# Altium project main_pcb_v1_0.PrjPcb (part 1 of 2)
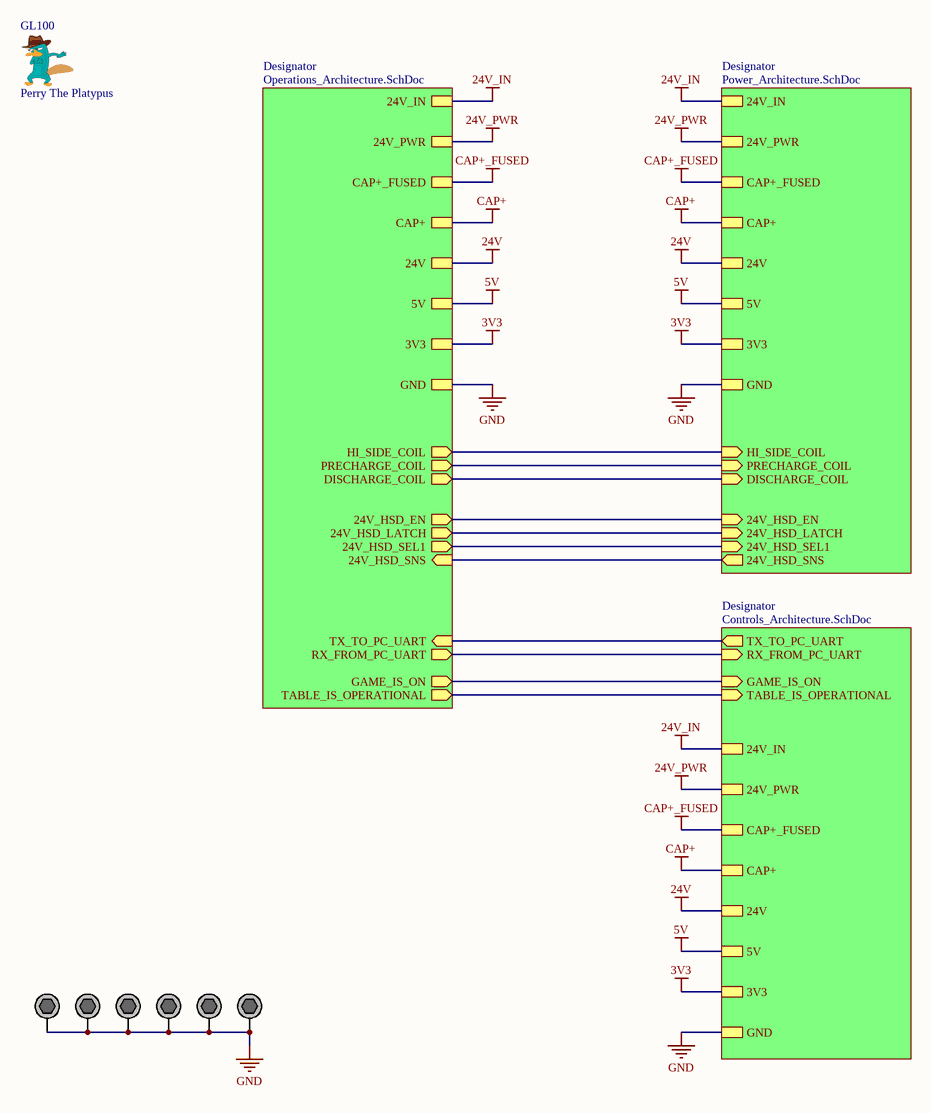
[diagram p0: Top_Level.SchDoc]
13 sheets, 195 parts. Net scope: strictly hierarchical (ports join the sheet entries above them; power ports are local).
Board file: main_pcb.PcbDoc
Sheets:
  Top_Level.SchDoc
    Designator = Power_Architecture.SchDoc
      Designator = 5V_Regulator.SchDoc
      Designator = 3V3_Regulator.SchDoc
    Designator = Operations_Architecture.SchDoc
      Designator = Relay_Control.SchDoc
      Designator = Monitoring.SchDoc
      Designator = Shutdown_Nodes.SchDoc
      Designator = Operations_Microcontroller.SchDoc
      Designator = MAX3232.SchDoc
    Designator = Controls_Architecture.SchDoc
      Designator = Controls_Microcontroller.SchDoc
      A = I_Sensing.SchDoc
      B = I_Sensing.SchDoc

## Sheet Top_Level.SchDoc: Top Level
size Letter; Date: Oct-10-2023; Author: Joe Thurston; DrawnBy: Joe Thurston; Engineer: Joe Thurston; SheetNumber: 1; SheetTotal: 13

### Parts
GL100  Perry The Platypus  [Perry the Platypus]  (no BOM)
MH100  M3 Mounting Hole Plated  [M3 Screw Hole - Plated]  (value not drawn)  (no BOM)
MH101  M3 Mounting Hole Plated  [M3 Screw Hole - Plated]  (value not drawn)  (no BOM)
MH102  M3 Mounting Hole Plated  [M3 Screw Hole - Plated]  (value not drawn)  (no BOM)
MH103  M3 Mounting Hole Plated  [M3 Screw Hole - Plated]  (value not drawn)  (no BOM)
MH104  M3 Mounting Hole Plated  [M3 Screw Hole - Plated]  (value not drawn)  (no BOM)
MH105  M3 Mounting Hole Plated  [M3 Screw Hole - Plated]  (value not drawn)  (no BOM)

### Sub-sheets
Designator = Power_Architecture.SchDoc: HI_SIDE_COIL (in), PRECHARGE_COIL (in), DISCHARGE_COIL (in), 24V_IN, 5V, 3V3, GND, 24V_PWR, CAP+_FUSED, CAP+, 24V, 24V_HSD_SEL1 (in), 24V_HSD_SNS (out), 24V_HSD_LATCH (in), 24V_HSD_EN (in)
Designator = Operations_Architecture.SchDoc: HI_SIDE_COIL (out), PRECHARGE_COIL (out), DISCHARGE_COIL (out), 24V_IN, 5V, 3V3, GND, 24V_PWR, CAP+_FUSED, CAP+, 24V, GAME_IS_ON (out), TABLE_IS_OPERATIONAL (out), TX_TO_PC_UART (in), RX_FROM_PC_UART (out), 24V_HSD_EN (out), 24V_HSD_LATCH (out), 24V_HSD_SEL1 (out), 24V_HSD_SNS (in)
Designator = Controls_Architecture.SchDoc: GAME_IS_ON (in), TABLE_IS_OPERATIONAL (in), 24V_IN, 5V, 3V3, GND, 24V_PWR, CAP+_FUSED, CAP+, 24V, TX_TO_PC_UART (out), RX_FROM_PC_UART (in)

### Nets
3V3: sheet Designator/3V3, sheet Designator/3V3, sheet Designator/3V3
5V: sheet Designator/5V, sheet Designator/5V, sheet Designator/5V
24V: sheet Designator/24V, sheet Designator/24V, sheet Designator/24V
24V_IN: sheet Designator/24V_IN, sheet Designator/24V_IN, sheet Designator/24V_IN
24V_PWR: sheet Designator/24V_PWR, sheet Designator/24V_PWR, sheet Designator/24V_PWR
CAP+: sheet Designator/CAP+, sheet Designator/CAP+, sheet Designator/CAP+
CAP+_FUSED: sheet Designator/CAP+_FUSED, sheet Designator/CAP+_FUSED, sheet Designator/CAP+_FUSED
GND: MH100.1 MH101.1 MH102.1 MH103.1 MH104.1 MH105.1 ; sheet Designator/GND, sheet Designator/GND, sheet Designator/GND
DISCHARGE_COIL: sheet Designator/DISCHARGE_COIL, sheet Designator/DISCHARGE_COIL
HI_SIDE_COIL_CURRENT: sheet Designator/HI_SIDE_COIL, sheet Designator/HI_SIDE_COIL
PRECHARGE_COIL_CURRENT: sheet Designator/PRECHARGE_COIL, sheet Designator/PRECHARGE_COIL
NetC202_2: sheet Designator/24V_HSD_SNS, sheet Designator/24V_HSD_SNS
NetR201_2: sheet Designator/24V_HSD_SEL1, sheet Designator/24V_HSD_SEL1
NetR206_2: sheet Designator/24V_HSD_LATCH, sheet Designator/24V_HSD_LATCH
NetR207_2: sheet Designator/24V_HSD_EN, sheet Designator/24V_HSD_EN
NetTP1302_1: sheet Designator/TABLE_IS_OPERATIONAL, sheet Designator/TABLE_IS_OPERATIONAL
NetTP1304_1: sheet Designator/GAME_IS_ON, sheet Designator/GAME_IS_ON
NetU800_9: sheet Designator/RX_FROM_PC_UART, sheet Designator/RX_FROM_PC_UART
NetU800_10: sheet Designator/TX_TO_PC_UART, sheet Designator/TX_TO_PC_UART

### Library data of the parts
MH100-MH105 = CMP-019-000000-2: Source: UBC Formula Electric.SchLib; Design Item ID: M3 Mounting Hole Plated

## Sheet Power_Architecture.SchDoc
size Tabloid; SheetNumber: 2; SheetTotal: 13
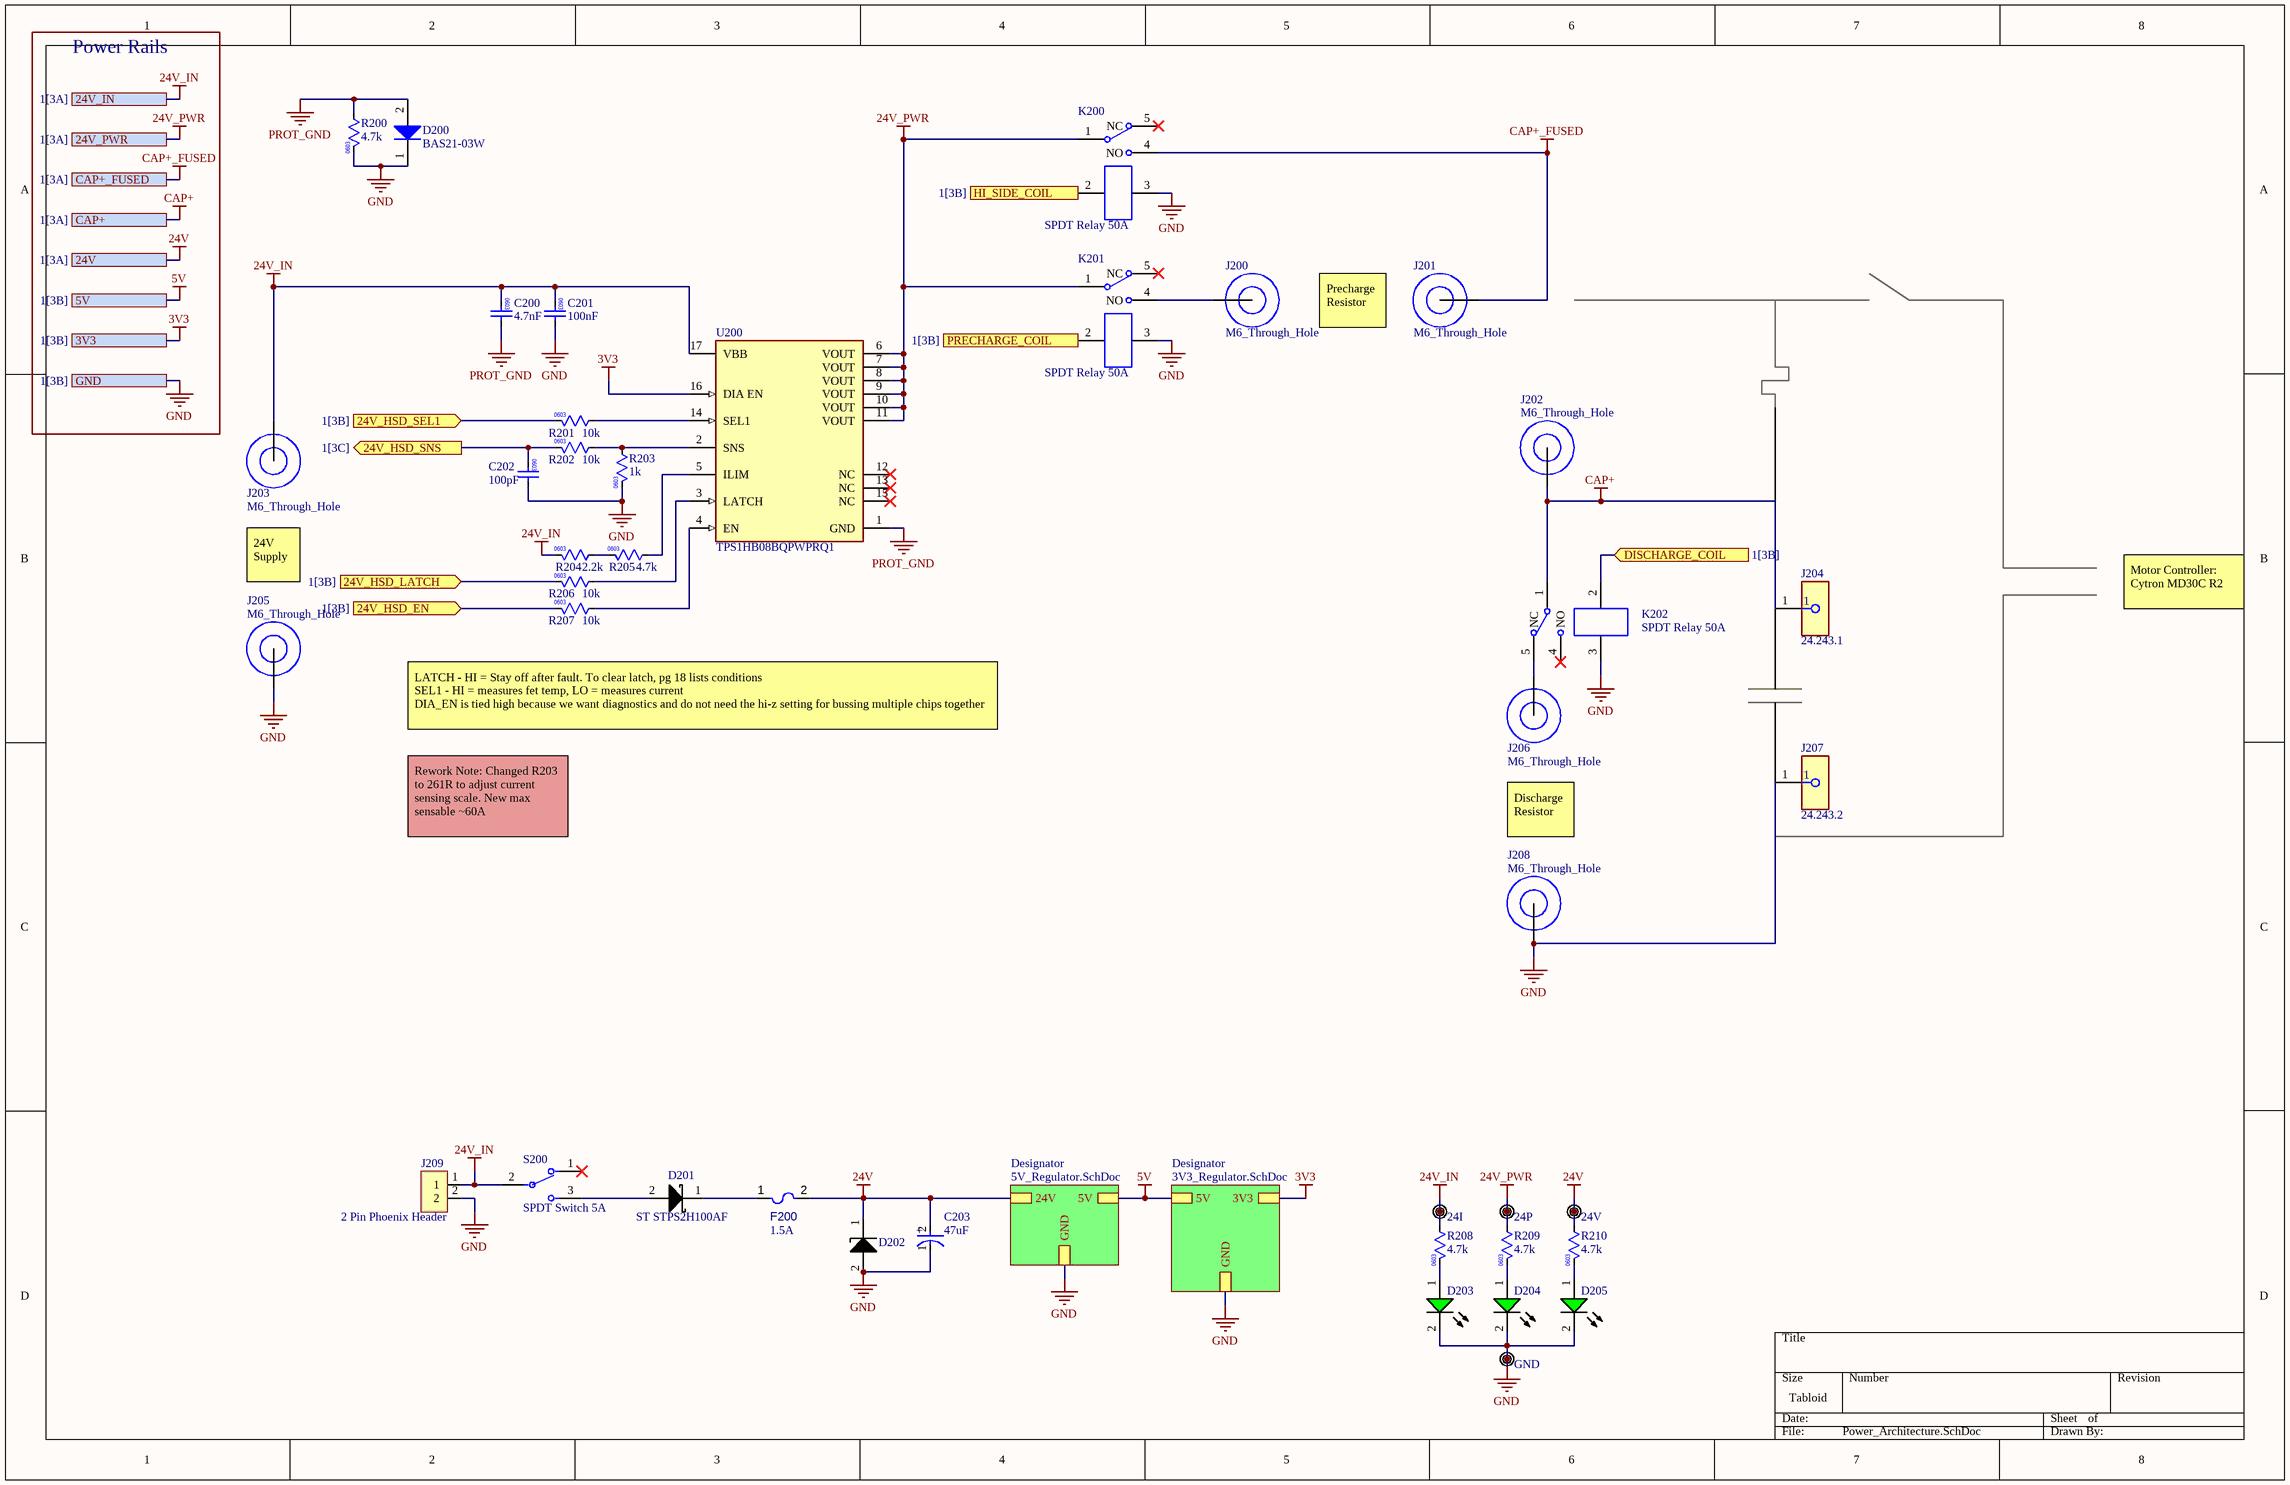
[diagram p1: Power_Architecture.SchDoc]

### Parts
C200  value 4.7nF  [0603 Capacitor Footprint]  (hidden comment: 0603 4.7nF 10% 50V)
C201  value 100nF  [0603 Capacitor Footprint]  (hidden comment: 0603 0.1uF 5% 50V)
C202  value 100pF  [0603 Capacitor Footprint]  (hidden comment: 0603 100pF 10% 50V)
C203  Capacitance: 47uF  [FP-FPD-MFG]  (hidden comment: EEEFP1V470AP)
D200  BAS21-03W  [INF-SOD323_V]
D201  ST STPS2H100AF  [ST STPS2H100AF]
D202  Vishay SMAJ24A-E3/5A  [VISHAY SMAJ24A-E3/5A (DO214AC/SMA)]  (value not drawn)
D203  Lite-On LTST-C193KGKT-5A  [Lite-On LTST-C193KGKT-5A GREEN (1608)]  (value not drawn)
D204  Lite-On LTST-C193KGKT-5A  [Lite-On LTST-C193KGKT-5A GREEN (1608)]  (value not drawn)
D205  Lite-On LTST-C193KGKT-5A  [Lite-On LTST-C193KGKT-5A GREEN (1608)]  (value not drawn)
F200  Current Rating: 1.5A  [LFUS-467_V]  (hidden comment: 1.5A 32V Fuse 0603)
GND  Thru-Hole Test Point  [TESTPOINT]  (value not drawn)  (no BOM)
J200  M6_Through_Hole  [M6_Through_Hole]  (no BOM)
J201  M6_Through_Hole  [M6_Through_Hole]  (no BOM)
J202  M6_Through_Hole  [M6_Through_Hole]  (no BOM)
J203  M6_Through_Hole  [M6_Through_Hole]  (no BOM)
J204  24.243.1  [FP-24_243_1-MFG]
J205  M6_Through_Hole  [M6_Through_Hole]  (no BOM)
J206  M6_Through_Hole  [M6_Through_Hole]  (no BOM)
J207  24.243.2  [FP-24_243_2-MFG]
J208  M6_Through_Hole  [M6_Through_Hole]  (no BOM)
J209  2 Pin Phoenix Header  [2 Pin Phoenix Header]
K200  SPDT Relay 50A  [SPDT Relay 50A]
K201  SPDT Relay 50A  [SPDT Relay 50A]
K202  SPDT Relay 50A  [SPDT Relay 50A]
R200  value 4.7k  [0603 Resistor Footprint]  (hidden comment: 0603 4k7 1% 0.33W)
R201  value 10k  [0603 Resistor Footprint]  (hidden comment: 0603 10k 1% 0.3W)
R202  value 10k  [0603 Resistor Footprint]  (hidden comment: 0603 10k 1% 0.3W)
R203  value 1k  [0603 Resistor Footprint]  (hidden comment: 0603 1k 1% 0.33W)
R204  value 2.2k  [0603 Resistor Footprint]  (hidden comment: 0603 2k2 1% 0.25W)
R205  value 4.7k  [0603 Resistor Footprint]  (hidden comment: 0603 4k7 1% 0.33W)
R206  value 10k  [0603 Resistor Footprint]  (hidden comment: 0603 10k 1% 0.3W)
R207  value 10k  [0603 Resistor Footprint]  (hidden comment: 0603 10k 1% 0.3W)
R208  value 4.7k  [0603 Resistor Footprint]  (hidden comment: 0603 4k7 1% 0.33W)
R209  value 4.7k  [0603 Resistor Footprint]  (hidden comment: 0603 4k7 1% 0.33W)
R210  value 4.7k  [0603 Resistor Footprint]  (hidden comment: 0603 4k7 1% 0.33W)
S200  SPDT Switch 5A  [SPDT 5A]
TP200  24I  [TESTPOINT]  (no BOM)
TP201  24P  [TESTPOINT]  (no BOM)
TP202  24V  [TESTPOINT]  (no BOM)
U200  TPS1HB08BQPWPRQ1  [FP-PWP0016M-MFG]

### Sub-sheets
Designator = 5V_Regulator.SchDoc: 24V, 5V, GND
Designator = 3V3_Regulator.SchDoc: 5V, GND, 3V3

### Ports
3V3 (see 1[3B]), 5V (see 1[3B]), 24V (see 1[3A]), 24V_HSD_EN (in, see 1[3B]), 24V_HSD_LATCH (in, see 1[3B]), 24V_HSD_SEL1 (in, see 1[3B]), 24V_HSD_SNS (out, see 1[3C]), 24V_IN (see 1[3A]), 24V_PWR (see 1[3A]), CAP+ (see 1[3A]), CAP+_FUSED (see 1[3A]), DISCHARGE_COIL (in, see 1[3B]), GND (see 1[3B]), HI_SIDE_COIL (in, see 1[3B]), PRECHARGE_COIL (in, see 1[3B])

### Nets
3V3: U200.16(DIA_EN) ; port 3V3, sheet Designator/3V3
5V: port 5V, sheet Designator/5V, sheet Designator/5V
24V: C203.2(A) D202.1 F200.2 R210.1 TP202.1(TP) ; port 24V, sheet Designator/24V
24V_IN: C200.2 C201.2 J203.1 J209.1 R204.2 R208.1 S200.2 TP200.1(TP) U200.17(VBB) ; port 24V_IN
24V_PWR: K200.1 K201.1 R209.1 TP201.1(TP) U200.6(VOUT) U200.7(VOUT) U200.8(VOUT) U200.9(VOUT) U200.10(VOUT) U200.11(VOUT) ; port 24V_PWR
CAP+: J202.1 J204.1 K202.1 ; port CAP+
CAP+_FUSED: J201.1 K200.4(NO) ; port CAP+_FUSED
GND: C201.1 C202.1 C203.1(C) D200.1(K) D202.2 D203.2(K) D204.2(K) D205.2(K) GND.1(TP) J205.1 J207.1 J208.1 J209.2 K200.3 K201.3 K202.3 R200.2 R203.2 ; port GND, sheet Designator/GND, sheet Designator/GND
PROT_GND: C200.1 D200.2(A) R200.1 U200.1(GND)
DISCHARGE_COIL: K202.2 ; port DISCHARGE_COIL
HI_SIDE_COIL_CURRENT: K200.2 ; port HI_SIDE_COIL
PRECHARGE_COIL_CURRENT: K201.2 ; port PRECHARGE_COIL
NetC202_2: C202.2 R202.2 ; port 24V_HSD_SNS
NetD201_1: D201.1 F200.1
NetD201_2: D201.2 S200.3
NetD203_1: D203.1(A) R208.2
NetD204_1: D204.1(A) R209.2
NetD205_1: D205.1(A) R210.2
NetJ200_1: J200.1 K201.4(NO)
NetJ206_1: J206.1 K202.5(NC)
NetR201_1: R201.1 U200.14(SEL1)
NetR201_2: R201.2 ; port 24V_HSD_SEL1
NetR202_1: R202.1 R203.1 U200.2(SNS)
NetR204_1: R204.1 R205.2
NetR205_1: R205.1 U200.5(ILIM)
NetR206_1: R206.1 U200.3(LATCH)
NetR206_2: R206.2 ; port 24V_HSD_LATCH
NetR207_1: R207.1 U200.4(EN)
NetR207_2: R207.2 ; port 24V_HSD_EN

Not connected (* = marked no-connect by the designer): K200 5(NC)*; K201 5(NC)*; K202 4(NO)*; S200 1*; U200 12(NC)* 13(NC)* 15(NC)*

### Notes on the sheet
- Power Rails
- Precharge Resistor
- 24V Supply
- Motor Controller: Cytron MD30C R2
- LATCH - HI = Stay off after fault. To clear latch, pg 18 lists conditions
  SEL1 - HI = measures fet temp, LO = measures current
  DIA_EN is tied high because we want diagnostics and do not need the hi-z setting for bussing multiple chips together
- Rework Note: Changed R203 to 261R to adjust current sensing scale. New max sensable ~60A
- Discharge Resistor
- (in symbol CMP-009-00190-8) 0603
- (in symbol CMP-2000-06216-2) +

### Library data of the parts
C200 = CMP-001-00087-1: Ceramic Capacitor, Multilayer, Ceramic, 50V, 10% Tol, X7R, 15% TC, 0.0047uF, Surface Mount, 0603; Max Operating Temperature: 125°C; Case/Package: 0603; Capacitor Type: Ceramic; Min Operating Temperature: -55°C; Tolerance: 10%; Supplier Part Number 1: 13-CC0603KPX7R9BB101CT-ND; RoHS Compliant: Yes; Temperature Characteristics Code: X7R; Mounting Technology: Surface Mount; Source: UBC Formula Electric.SchLib; Voltage Rating: 50V; Pins: 2
C201 = CMP-001-00091-5: CAP CER 0.1UF 50V X7R 0603; Manufacturer Part Number: CC0603JPX7R9BB104; Capacitor Type: Ceramic; Case/Package: 0603; Tolerance: 5%; Voltage Rating: 50V; Mounting Technology: SF
C202 = CMP-001-00096-1: Ceramic Capacitor, Multilayer, Ceramic, 50V, 10% +Tol, 10% -Tol, X7R, 15% TC, 0.0001uF, Surface Mount, 0603; Min Operating Temperature: -55°C; Voltage Rating: 50V; Tolerance: 10%; Supplier 1: Yageo; Capacitor Type: Ceramic; Pins: 2; Case/Package: 0603; Mounting Technology: Surface Mount; RoHS Compliant: Yes; Source: UBC Formula Electric.SchLib; Max Operating Temperature: 125°C; Supplier Part Number 1: 13-CC0603KPX7R9BB101CT-ND; Temperature Characteristics Code: X7R
C203 = CMP-2000-06216-2: CAP ALUM 47UF 20% 35V SMD; Ripple Current: 300mA; ESR (Equivalent Series Resistance): 260mR; Life (Hours): 2000Hour; Leakage Current: 3uA; Dissipation Factor: 0.12%; Material: Aluminium; Series: FP; Construction: Cylindrical; Contact Plating: Tin; Termination: SMD/SMT; RoHS Compliant: Yes; Voltage Rating (DC): 35V; Package Quantity: 1; Tolerance: 20%; Mount: Surface Mount; Diameter: 6.3mm; Lead Free: Lead Free; Number of Pins: 2; Radiation Hardening: No; REACH SVHC: No SVHC; Length: 5.8mm; Height - Seated (Max): 0.228inch; Ripple Current (AC): 300mA; Packaging: Tape and Reel; Voltage Rating: 35V; Min Operating Temperature: -55°C; Voltage: 35V; Case/Package: Radial; Max Operating Temperature: 105°C; Height: 5.8mm; Lead Pitch: 1.8mm
D200 = CMP-1176-00009-1: Silicon Switching Diode, SOD323, Reel, Green; Manufacturer: Infineon; IF (max): 250Â mA; VBR (min): 250Â V; Green: TRUE; Configuration: Single; VR (max): 200Â V; IR (max): 100Â nA; VF (max): 1.25Â V; trr (max): 50Â ns; PackageReference: SOD323; ComponentLink3URL: http://www.infineon.com/dgdl/SOD323-Package_Overview.pdf?folderId=db3a30431936bc4b011952aab84f3bbe&fileId=db3a30431936bc4b011952beed653be3; ComponentLink1URL: http://www.infineon.com/; Mounting Technology: Surface Mount; ComponentLink3Description: Package Specification; ComponentLink2URL: http://www.infineon.com/dgdl/bas21series.pdf?folderId=db3a30431400ef6801141b5844e103ea&fileId=db3a30431400ef6801141bed353f040f; PartNumber: BAS21-03W; ComponentLink2Description: Datasheet; ComponentLink1Description: Manufacturer URL; PackageDescription: 2-Pin Small Outline Diode Package, 1.25 x 1.7 mm Body
D201 = CMP-011-0012-1: Diode Schottky 100V 2A Surface Mount SMAflat; Component Type: Standard; Source: Quad_Inverter.SchLib; Design Item ID: ST STPS2H100AF; Pins: 2
D202 = CMP-024-000024-1: TVS DIODE 24V 38.9V DO214AC; Source: UBC Formula Electric.SchLib; Supplier Part Number 1: SMAJ24A-E3/5AGICT-ND; Reverse Standoff: 24V; Design Item ID: Vishay SMAJ24A-E3/5A; Supplier 1: Digi-Key
D203-D205 = CMP-026-000009-1: LED GREEN CLEAR CHIP SMD; Source: UBC Formula Electric.SchLib; Supplier 1: Digi-Key; Supplier Part Number 1: 160-1828-1-ND; Design Item ID: Lite-On LTST-C193KGKT-5A
F200 = CMP-005-00014-1: Electric Fuse, Slow Blow, 1.5A, 32VDC, 50A (IR), Surface Mount; Case/Package: 0603; Pins: 2; Min Operating Temperature: -20°C; Max Operating Temperature: 105°C; Mounting Technology: Surface Mount; Voltage Rating - DC: 32V; RoHS Compliant: Yes
GND TP200-TP202 = CMP-020-0000-4: Design Item ID: Thru-Hole Test Point; Source: UBC Formula Electric.SchLib
J204 = CMP-12400-000001-2: Banana Test Connector, 4mm, Socket, PCB Mount, 24 A, 60 VDC, Silver Plated Contacts, Green; Gender: Male; Voltage Rating: 30V; Current Rating: 20A; REACH SVHC: No SVHC; Contact Material: Brass; RoHS Compliant: Yes; Contact Plating: Silver; Voltage Rating (DC): 30V; Length: 24mm; Termination: Solder
J207 = CMP-12400-000002-2: RECEPTACLE, 20A, 4MM, PCB, SOLDER, BLACK; Gender: Male; Current Rating: 20A; Contact Plating: Silver; Termination: Solder; Length: 24mm; REACH SVHC: No SVHC; Contact Material: Brass
R200 R205 R208-R210 = CMP-009-00182-7: RES SMD 4.7K OHM 1% 1/3W 0603; Manufacturer Part Number: CRCW06034K70FKEAHP; Power: 250mW; Tolerance: 1%; Case/Package: 0603; Pins: 2; RoHS Compliant: Yes; Min Operating Temperature: -55°C; Mounting Technology: Surface Mount; Digikey Part Number: 541-4.70KSCT-ND; Max Operating Temperature: 155°C
R201 R202 R206 R207 = CMP-009-00181-10: RES SMD 10K OHM 1% 1/3W 0603; Manufacturer Part Number: CRCW060310K0FKEAHP; Power: 333mW; Case/Package: 0603; Max Operating Temperature: 155°C; Min Operating Temperature: -55°C; Pins: 2; Digikey Part Number: 541-10.0KSCT-ND; RoHS Compliant: Yes; Tolerance: 1%; Mounting Technology: Surface Mount
R203 = CMP-009-00184-7: RES SMD 1K OHM 1% 1/3W 0603; Manufacturer Part Number: CRCW06031K00FKEAHP; Power: 250mW; RoHS Compliant: Yes; Pins: 2; Min Operating Temperature: -55°C; Max Operating Temperature: 155°C; Tolerance: 1%; Digikey Part Number: 541-1.00KSCT-ND; Case/Package: 0603; Mounting Technology: Surface Mount
R204 = CMP-009-00190-8: RES SMD 2.2K OHM 1% 1/4W 0603; Manufacturer Part Number: RCS06032K20FKEA; Digikey Part Number: 541-10449-1-ND
U200 = CMP-00024-00007-1: Power Switch/Driver 1:1 N-Channel 70A 16-HTSSOP; Voltage Rating: 28V; Min Operating Temperature: -40°C; Case/Package: 16-HTSSOP; Max Operating Temperature: 125°C
K200-K202 = SPDT Relay 50A: Supplier 1: Digi-Key; Supplier Part Number 1: 2449-J115F11CH24VDCS61.5-ND

## Sheet 5V_Regulator.SchDoc
size Letter; SheetNumber: 3; SheetTotal: 13
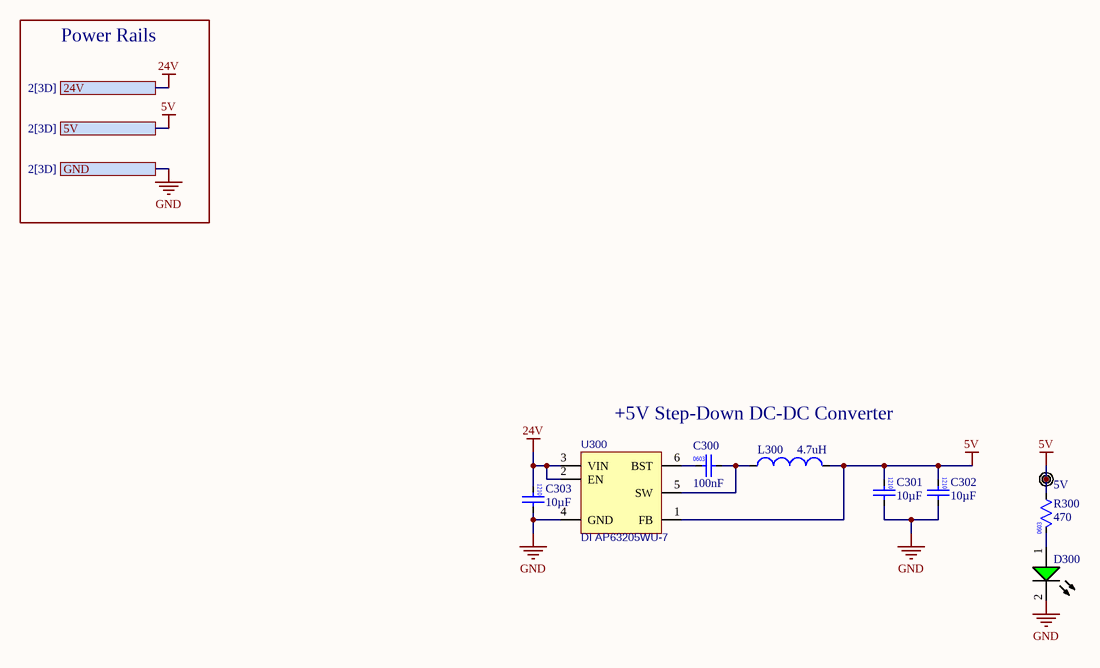
[diagram p2: 5V_Regulator.SchDoc]

### Parts
C300  value 100nF  [0603 Capacitor Footprint]  (hidden comment: 0603 0.1uF 5% 50V)
C301  value 10µF  [1210 CAPACTIOR (TDK C-SERIES)]  (hidden comment: 1210 10uF 10% 50V)
C302  value 10µF  [1210 CAPACTIOR (TDK C-SERIES)]  (hidden comment: 1210 10uF 10% 50V)
C303  value 10µF  [1210 CAPACTIOR (TDK C-SERIES)]  (hidden comment: 1210 10uF 10% 50V)
D300  Lite-On LTST-C193KGKT-5A  [Lite-On LTST-C193KGKT-5A GREEN (1608)]  (value not drawn)
L300  Inductance: 4.7uH  [BOURNS SRN6045-4R7Y]  (hidden comment: Bourns SRN6045-4R7Y)
R300  value 470  [0603 Resistor Footprint]  (hidden comment: 0603 470R 5% 0.25W)
TP300  5V  [TESTPOINT]  (no BOM)
U300  DI AP63205WU-7  [Diodes Incorporated AP63205WU-7]

### Ports
5V (see 2[3D]), 24V (see 2[3D]), GND (see 2[3D])

### Nets
5V: C301.2 C302.2 L300.2 R300.1 TP300.1(TP) U300.1(FB) ; port 5V
24V: C303.2 U300.2(EN) U300.3(VIN) ; port 24V
GND: C301.1 C302.1 C303.1 D300.2(K) U300.4(GND) ; port GND
NetC300_1: C300.1 L300.1 U300.5(SW)
NetC300_2: C300.2 U300.6(BST)
NetD300_1: D300.1(A) R300.2

### Notes on the sheet
- Power Rails
- +5V Step-Down DC-DC Converter

### Library data of the parts
C300 = CMP-001-00091-5: as C201 on sheet Power_Architecture; Case/Package: 0603; Tolerance: 5%; Voltage Rating: 50V; Mounting Technology: SF
C301-C303 = CMP-001-00098-1: Ceramic Capacitor, Multilayer, Ceramic, 50V, 10% Tol, X7R, 15% TC, 10uF, Surface Mount, 1210; Capacitor Type: Ceramic; Min Operating Temperature: -55°C; Source: UBC Formula Electric.SchLib; Mounting Technology: Surface Mount; Case/Package: 1210; Pins: 2; Voltage Rating: 50V; Tolerance: 10%; Design Item ID: 1210 Generic Ceramic Capacitor; RoHS Compliant: Yes; Max Operating Temperature: 125°C
D300 = CMP-026-000009-1: LED GREEN CLEAR CHIP SMD; Source: UBC Formula Electric.SchLib; Supplier 1: Digi-Key; Supplier Part Number 1: 160-1828-1-ND; Design Item ID: Lite-On LTST-C193KGKT-5A
L300 = CMP-032-000001-1: FIXED IND 4.7UH 3A 37.6 MOHM SMD; Supplier Part Number 1: SRN6045-4R7YCT-ND; Supplier 1: Digi-Key; Source: UBC Formula Electric.SchLib; Design Item ID: Bourns SRN6045-4R7Y
R300 = CMP-009-00193-4: Res Thick Film 0603 470 Ohm 5% 0.25W(1/4W) ±200ppm/C Pad SMD Automotive T/R; Manufacturer Part Number: ERJ-PA3J471V; Power: 250mW; Tolerance: 5%; Max Operating Temperature: 155°C; Digikey Part Number: P470BZCT-ND; Case/Package: 0603; Mounting Technology: Surface Mount; Pins: 2; RoHS Compliant: Yes; Min Operating Temperature: -55°C
TP300 = CMP-020-0000-4: Design Item ID: Thru-Hole Test Point; Source: UBC Formula Electric.SchLib
U300 = CMP-025-000004-2: IC REG BUCK 5V 2A TSOT26; Design Item ID: DI AP63205WU-7

## Sheet 3V3_Regulator.SchDoc
size Letter; SheetNumber: 4; SheetTotal: 13
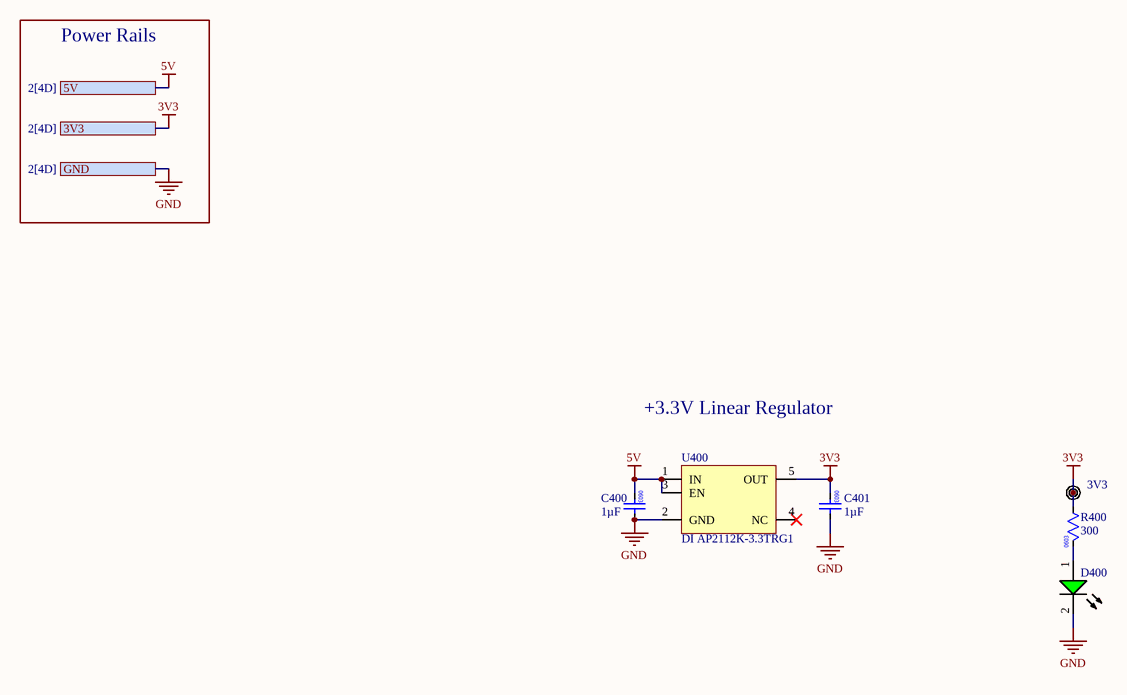
[diagram p3: 3V3_Regulator.SchDoc]

### Parts
C400  value 1µF  [0603 Capacitor Footprint]  (hidden comment: 0603 1uF 10% 25V)
C401  value 1µF  [0603 Capacitor Footprint]  (hidden comment: 0603 1uF 10% 25V)
D400  Lite-On LTST-C193KGKT-5A  [Lite-On LTST-C193KGKT-5A GREEN (1608)]  (value not drawn)
R400  value 300  [0603 Resistor Footprint]  (hidden comment: 0603 300 1% 0.33W)
TP400  3V3  [TESTPOINT]  (no BOM)
U400  DI AP2112K-3.3TRG1  [DI AP2112K-3.3TRG1]

### Ports
3V3 (see 2[4D]), 5V (see 2[4D]), GND (see 2[4D])

### Nets
3V3: C401.2 R400.1 TP400.1(TP) U400.5(OUT) ; port 3V3
5V: C400.2 U400.1(IN) U400.3(EN) ; port 5V
GND: C400.1 C401.1 D400.2(K) U400.2(GND) ; port GND
NetD400_1: D400.1(A) R400.2

Not connected (* = marked no-connect by the designer): U400 4(NC)*

### Notes on the sheet
- Power Rails
- +3.3V Linear Regulator

### Library data of the parts
C400 C401 = CMP-001-00092-5: CAP CER 1UF 25V X7R 0603; Manufacturer Part Number: GCM188R71E105KA64J; Capacitor Type: Ceramic; Case/Package: 0603; Max Operating Temperature: 125°C; Supplier Part Number 1: 490-GCM188R71E105KA64JCT-ND; RoHS Compliant: Yes; Supplier 1: Digikey; Pins: 2; Digikey Part Number: 490-GCM188R71E105KA64JCT-ND; Tolerance: 10%; Voltage Rating: 25V; Mounting Technology: Surface Mount; Min Operating Temperature: -55°C
D400 = CMP-026-000009-1: LED GREEN CLEAR CHIP SMD; Source: UBC Formula Electric.SchLib; Supplier 1: Digi-Key; Supplier Part Number 1: 160-1828-1-ND; Design Item ID: Lite-On LTST-C193KGKT-5A
R400 = CMP-009-00191-7: RES SMD 300 OHM 1% 1/3W 0603; Manufacturer Part Number: CRCW0603300RFKEAHP; Power: 250mW; Tolerance: 1%; Max Operating Temperature: 155°C; Digikey Part Number: 541-CRCW0603300RFKEAHPCT-ND; Case/Package: 0603; Mounting Technology: Surface Mount; Pins: 2; RoHS Compliant: Yes; Min Operating Temperature: -55°C
TP400 = CMP-020-0000-4: Design Item ID: Thru-Hole Test Point; Source: UBC Formula Electric.SchLib
U400 = CMP-010-0000-1: Linear Voltage Regulator IC Positive Fixed 1 Output  600mA SOT-25; Design Item ID: DI AP2112K-3.3TRG1; Component Type: Standard; Source: Quad_Inverter.SchLib; Pins: 5

## Sheet Operations_Architecture.SchDoc
size Tabloid; SheetNumber: 5; SheetTotal: 13
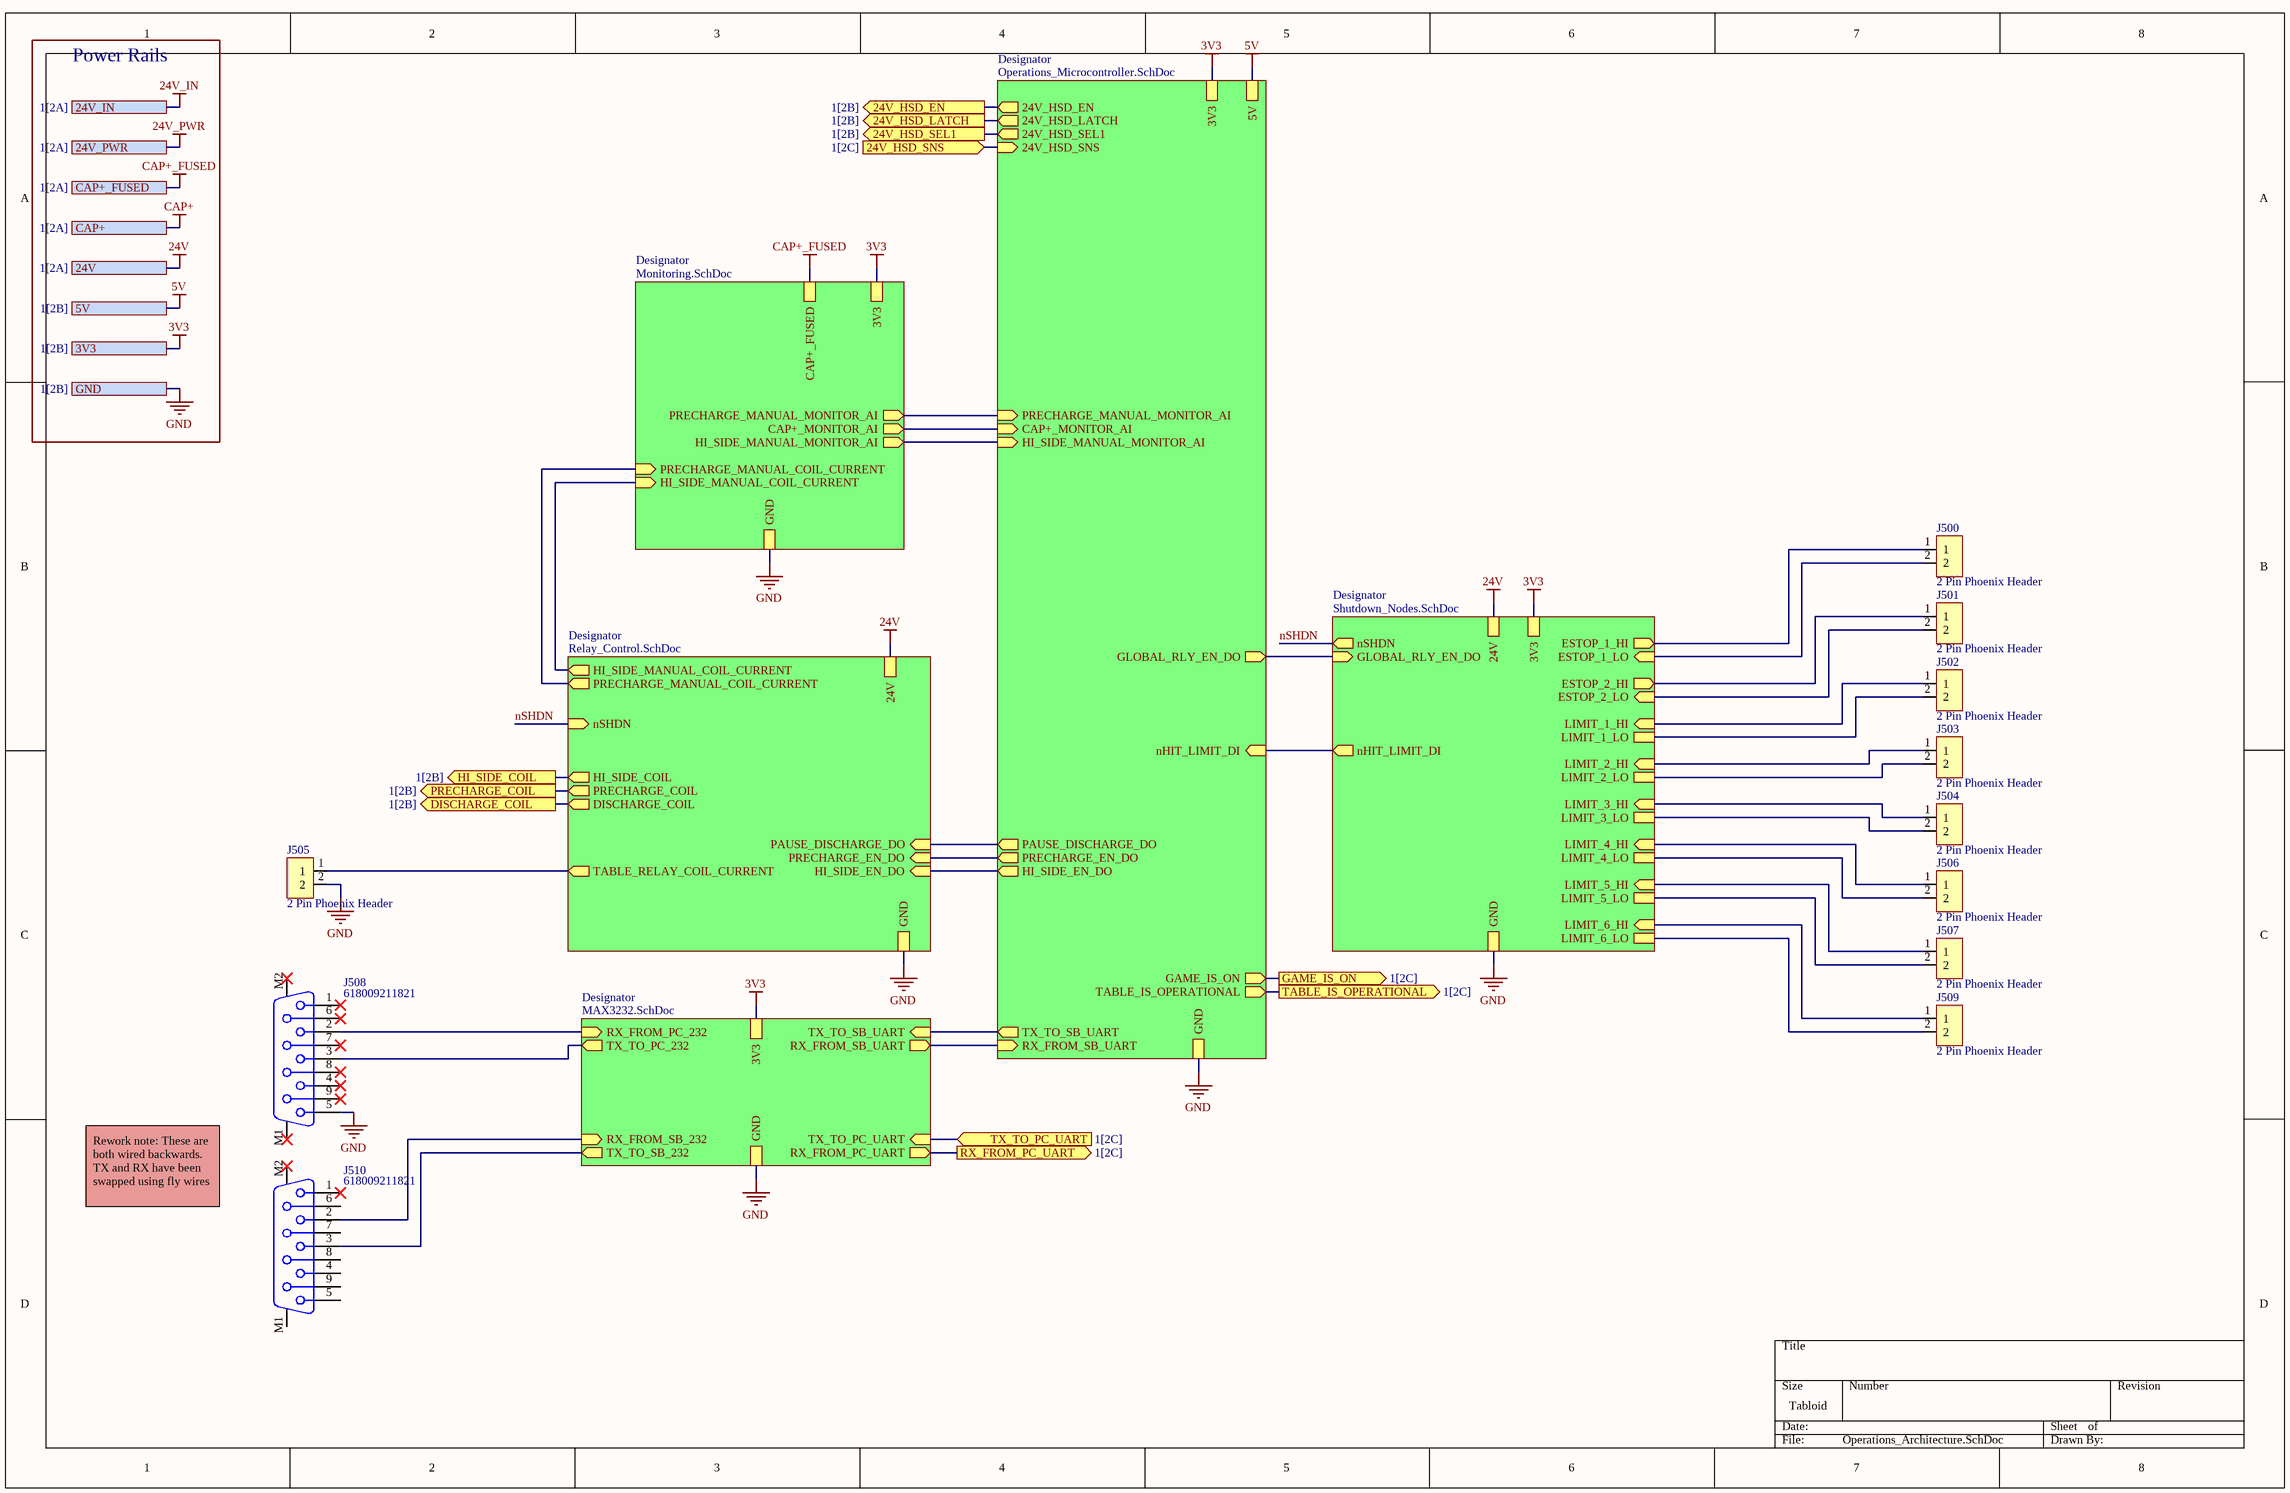
[diagram p4: Operations_Architecture.SchDoc]

### Parts
J500  2 Pin Phoenix Header  [2 Pin Phoenix Header]
J501  2 Pin Phoenix Header  [2 Pin Phoenix Header]
J502  2 Pin Phoenix Header  [2 Pin Phoenix Header]
J503  2 Pin Phoenix Header  [2 Pin Phoenix Header]
J504  2 Pin Phoenix Header  [2 Pin Phoenix Header]
J505  2 Pin Phoenix Header  [2 Pin Phoenix Header]
J506  2 Pin Phoenix Header  [2 Pin Phoenix Header]
J507  2 Pin Phoenix Header  [2 Pin Phoenix Header]
J508  618009211821  [618009211821]
J509  2 Pin Phoenix Header  [2 Pin Phoenix Header]
J510  618009211821  [618009211821]

### Sub-sheets
Designator = Relay_Control.SchDoc: nSHDN (in), TABLE_RELAY_COIL_CURRENT (out), 24V, GND, PRECHARGE_MANUAL_COIL_CURRENT (out), HI_SIDE_MANUAL_COIL_CURRENT (out), PAUSE_DISCHARGE_DO (in), PRECHARGE_EN_DO (in), HI_SIDE_EN_DO (in), DISCHARGE_COIL (out), HI_SIDE_COIL (out), PRECHARGE_COIL (out)
Designator = Monitoring.SchDoc: CAP+_MONITOR_AI (out), HI_SIDE_MANUAL_MONITOR_AI (out), PRECHARGE_MANUAL_MONITOR_AI (out), HI_SIDE_MANUAL_COIL_CURRENT (in), PRECHARGE_MANUAL_COIL_CURRENT (in), 3V3, GND, CAP+_FUSED
Designator = Shutdown_Nodes.SchDoc: ESTOP_1_HI (out), ESTOP_1_LO (in), ESTOP_2_HI (out), ESTOP_2_LO (in), nSHDN (out), LIMIT_1_HI (in), LIMIT_1_LO, LIMIT_2_HI (in), LIMIT_2_LO, LIMIT_3_HI (in), LIMIT_3_LO, LIMIT_4_HI (in), LIMIT_4_LO, LIMIT_5_HI (in), LIMIT_5_LO, LIMIT_6_HI (in), LIMIT_6_LO, nHIT_LIMIT_DI (out), GLOBAL_RLY_EN_DO (in), 24V, GND, 3V3
Designator = Operations_Microcontroller.SchDoc: PAUSE_DISCHARGE_DO (out), PRECHARGE_EN_DO (out), HI_SIDE_EN_DO (out), GLOBAL_RLY_EN_DO (out), nHIT_LIMIT_DI (in), TX_TO_SB_UART (out), RX_FROM_SB_UART (in), CAP+_MONITOR_AI (in), HI_SIDE_MANUAL_MONITOR_AI (in), PRECHARGE_MANUAL_MONITOR_AI (in), GAME_IS_ON (out), TABLE_IS_OPERATIONAL (out), 3V3, GND, 24V_HSD_EN (out), 24V_HSD_LATCH (out), 24V_HSD_SEL1 (out), 24V_HSD_SNS (in), 5V
Designator = MAX3232.SchDoc: TX_TO_PC_232 (out), RX_FROM_PC_232 (in), TX_TO_SB_232 (out), RX_FROM_SB_232 (in), 3V3, GND, TX_TO_SB_UART (in), RX_FROM_SB_UART (out), TX_TO_PC_UART (in), RX_FROM_PC_UART (out)

### Ports
3V3 (see 1[2B]), 5V (see 1[2B]), 24V (see 1[2A]), 24V_HSD_EN (out, see 1[2B]), 24V_HSD_LATCH (out, see 1[2B]), 24V_HSD_SEL1 (out, see 1[2B]), 24V_HSD_SNS (in, see 1[2C]), 24V_IN (see 1[2A]), 24V_PWR (see 1[2A]), CAP+ (see 1[2A]), CAP+_FUSED (see 1[2A]), DISCHARGE_COIL (out, see 1[2B]), GAME_IS_ON (out, see 1[2C]), GND (see 1[2B]), HI_SIDE_COIL (out, see 1[2B]), PRECHARGE_COIL (out, see 1[2B]), RX_FROM_PC_UART (out, see 1[2C]), TABLE_IS_OPERATIONAL (out, see 1[2C]), TX_TO_PC_UART (in, see 1[2C])

### Nets
3V3: port 3V3, sheet Designator/3V3, sheet Designator/3V3, sheet Designator/3V3, sheet Designator/3V3
5V: port 5V, sheet Designator/5V
24V: port 24V, sheet Designator/24V, sheet Designator/24V
CAP+_FUSED: port CAP+_FUSED, sheet Designator/CAP+_FUSED
GND: J502.2 J503.2 J504.2 J505.2 J506.2 J507.2 J508.5 J509.2 ; port GND, sheet Designator/GND, sheet Designator/GND, sheet Designator/LIMIT_1_LO, sheet Designator/LIMIT_2_LO, sheet Designator/LIMIT_3_LO, sheet Designator/LIMIT_4_LO, sheet Designator/LIMIT_5_LO, sheet Designator/LIMIT_6_LO, sheet Designator/GND, sheet Designator/GND, sheet Designator/GND
DISCHARGE_COIL: port DISCHARGE_COIL, sheet Designator/DISCHARGE_COIL
HI_SIDE_COIL_CURRENT: port HI_SIDE_COIL, sheet Designator/HI_SIDE_COIL
HI_SIDE_MANUAL_COIL_CURRENT: sheet Designator/HI_SIDE_MANUAL_COIL_CURRENT, sheet Designator/HI_SIDE_MANUAL_COIL_CURRENT
nHIT_LIMIT: J502.1 J503.1 J504.1 J506.1 J507.1 J509.1 ; sheet Designator/LIMIT_1_HI, sheet Designator/LIMIT_2_HI, sheet Designator/LIMIT_3_HI, sheet Designator/LIMIT_4_HI, sheet Designator/LIMIT_5_HI, sheet Designator/LIMIT_6_HI, sheet Designator/nHIT_LIMIT_DI, sheet Designator/GLOBAL_RLY_EN_DO, sheet Designator/GLOBAL_RLY_EN_DO, sheet Designator/nHIT_LIMIT_DI
nSHDN: J505.1 ; sheet Designator/nSHDN, sheet Designator/TABLE_RELAY_COIL_CURRENT, sheet Designator/nSHDN
PRECHARGE_COIL_CURRENT: port PRECHARGE_COIL, sheet Designator/PRECHARGE_COIL
PRECHARGE_MANUAL_COIL_CURRENT: sheet Designator/PRECHARGE_MANUAL_COIL_CURRENT, sheet Designator/PRECHARGE_MANUAL_COIL_CURRENT
NetC202_2: port 24V_HSD_SNS, sheet Designator/24V_HSD_SNS
NetD901_1: J500.1 ; sheet Designator/ESTOP_1_HI
NetD902_1: J500.2 J501.1 ; sheet Designator/ESTOP_1_LO, sheet Designator/ESTOP_2_HI
NetD903_1: J501.2 ; sheet Designator/ESTOP_2_LO
NetD1000_3: sheet Designator/CAP+_MONITOR_AI, sheet Designator/CAP+_MONITOR_AI
NetD1001_3: sheet Designator/HI_SIDE_MANUAL_MONITOR_AI, sheet Designator/HI_SIDE_MANUAL_MONITOR_AI
NetD1002_3: sheet Designator/PRECHARGE_MANUAL_MONITOR_AI, sheet Designator/PRECHARGE_MANUAL_MONITOR_AI
NetJ508_2: J508.2 ; sheet Designator/RX_FROM_PC_232
NetJ508_3: J508.3 ; sheet Designator/TX_TO_PC_232
NetJ510_2: J510.2 ; sheet Designator/RX_FROM_SB_232
NetJ510_3: J510.3 ; sheet Designator/TX_TO_SB_232
NetQ700_1: sheet Designator/PRECHARGE_EN_DO, sheet Designator/PRECHARGE_EN_DO
NetQ701_1: sheet Designator/HI_SIDE_EN_DO, sheet Designator/HI_SIDE_EN_DO
NetQ702_1: sheet Designator/PAUSE_DISCHARGE_DO, sheet Designator/PAUSE_DISCHARGE_DO
NetR201_2: port 24V_HSD_SEL1, sheet Designator/24V_HSD_SEL1
NetR206_2: port 24V_HSD_LATCH, sheet Designator/24V_HSD_LATCH
NetR207_2: port 24V_HSD_EN, sheet Designator/24V_HSD_EN
NetTP1302_1: port TABLE_IS_OPERATIONAL, sheet Designator/TABLE_IS_OPERATIONAL
NetTP1304_1: port GAME_IS_ON, sheet Designator/GAME_IS_ON
NetU800_9: port RX_FROM_PC_UART, sheet Designator/RX_FROM_PC_UART
NetU800_10: port TX_TO_PC_UART, sheet Designator/TX_TO_PC_UART
NetU800_11: sheet Designator/TX_TO_SB_UART, sheet Designator/TX_TO_SB_UART
NetU800_12: sheet Designator/RX_FROM_SB_UART, sheet Designator/RX_FROM_SB_UART

Not connected (* = marked no-connect by the designer): J508 1* 4* 6* 7* 8* 9* M1* M2*; J510 1* 4 5 6 7 8 9 M1 M2*

### Notes on the sheet
- Power Rails
- Rework note: These are both wired backwards. TX and RX have been swapped using fly wires

### Library data of the parts
J508 J510 = CMP-1502-00208-2: NexarPartId: 89205517; Gender: Female; Contact Resistance: 30mΩ; Insulation Resistance: 5GΩ; Current Rating: 3A; Operating Supply Voltage: 125V; Pitch: 2.77mm; Insulation Material: PBT; Contact Plating: Gold; Number of Pins: 9; RoHS: Compliant; Max Operating Temperature: 105°C; Length: 16.33mm; Min Operating Temperature: -55°C

## Sheet Relay_Control.SchDoc
size Tabloid; SheetNumber: 6; SheetTotal: 13
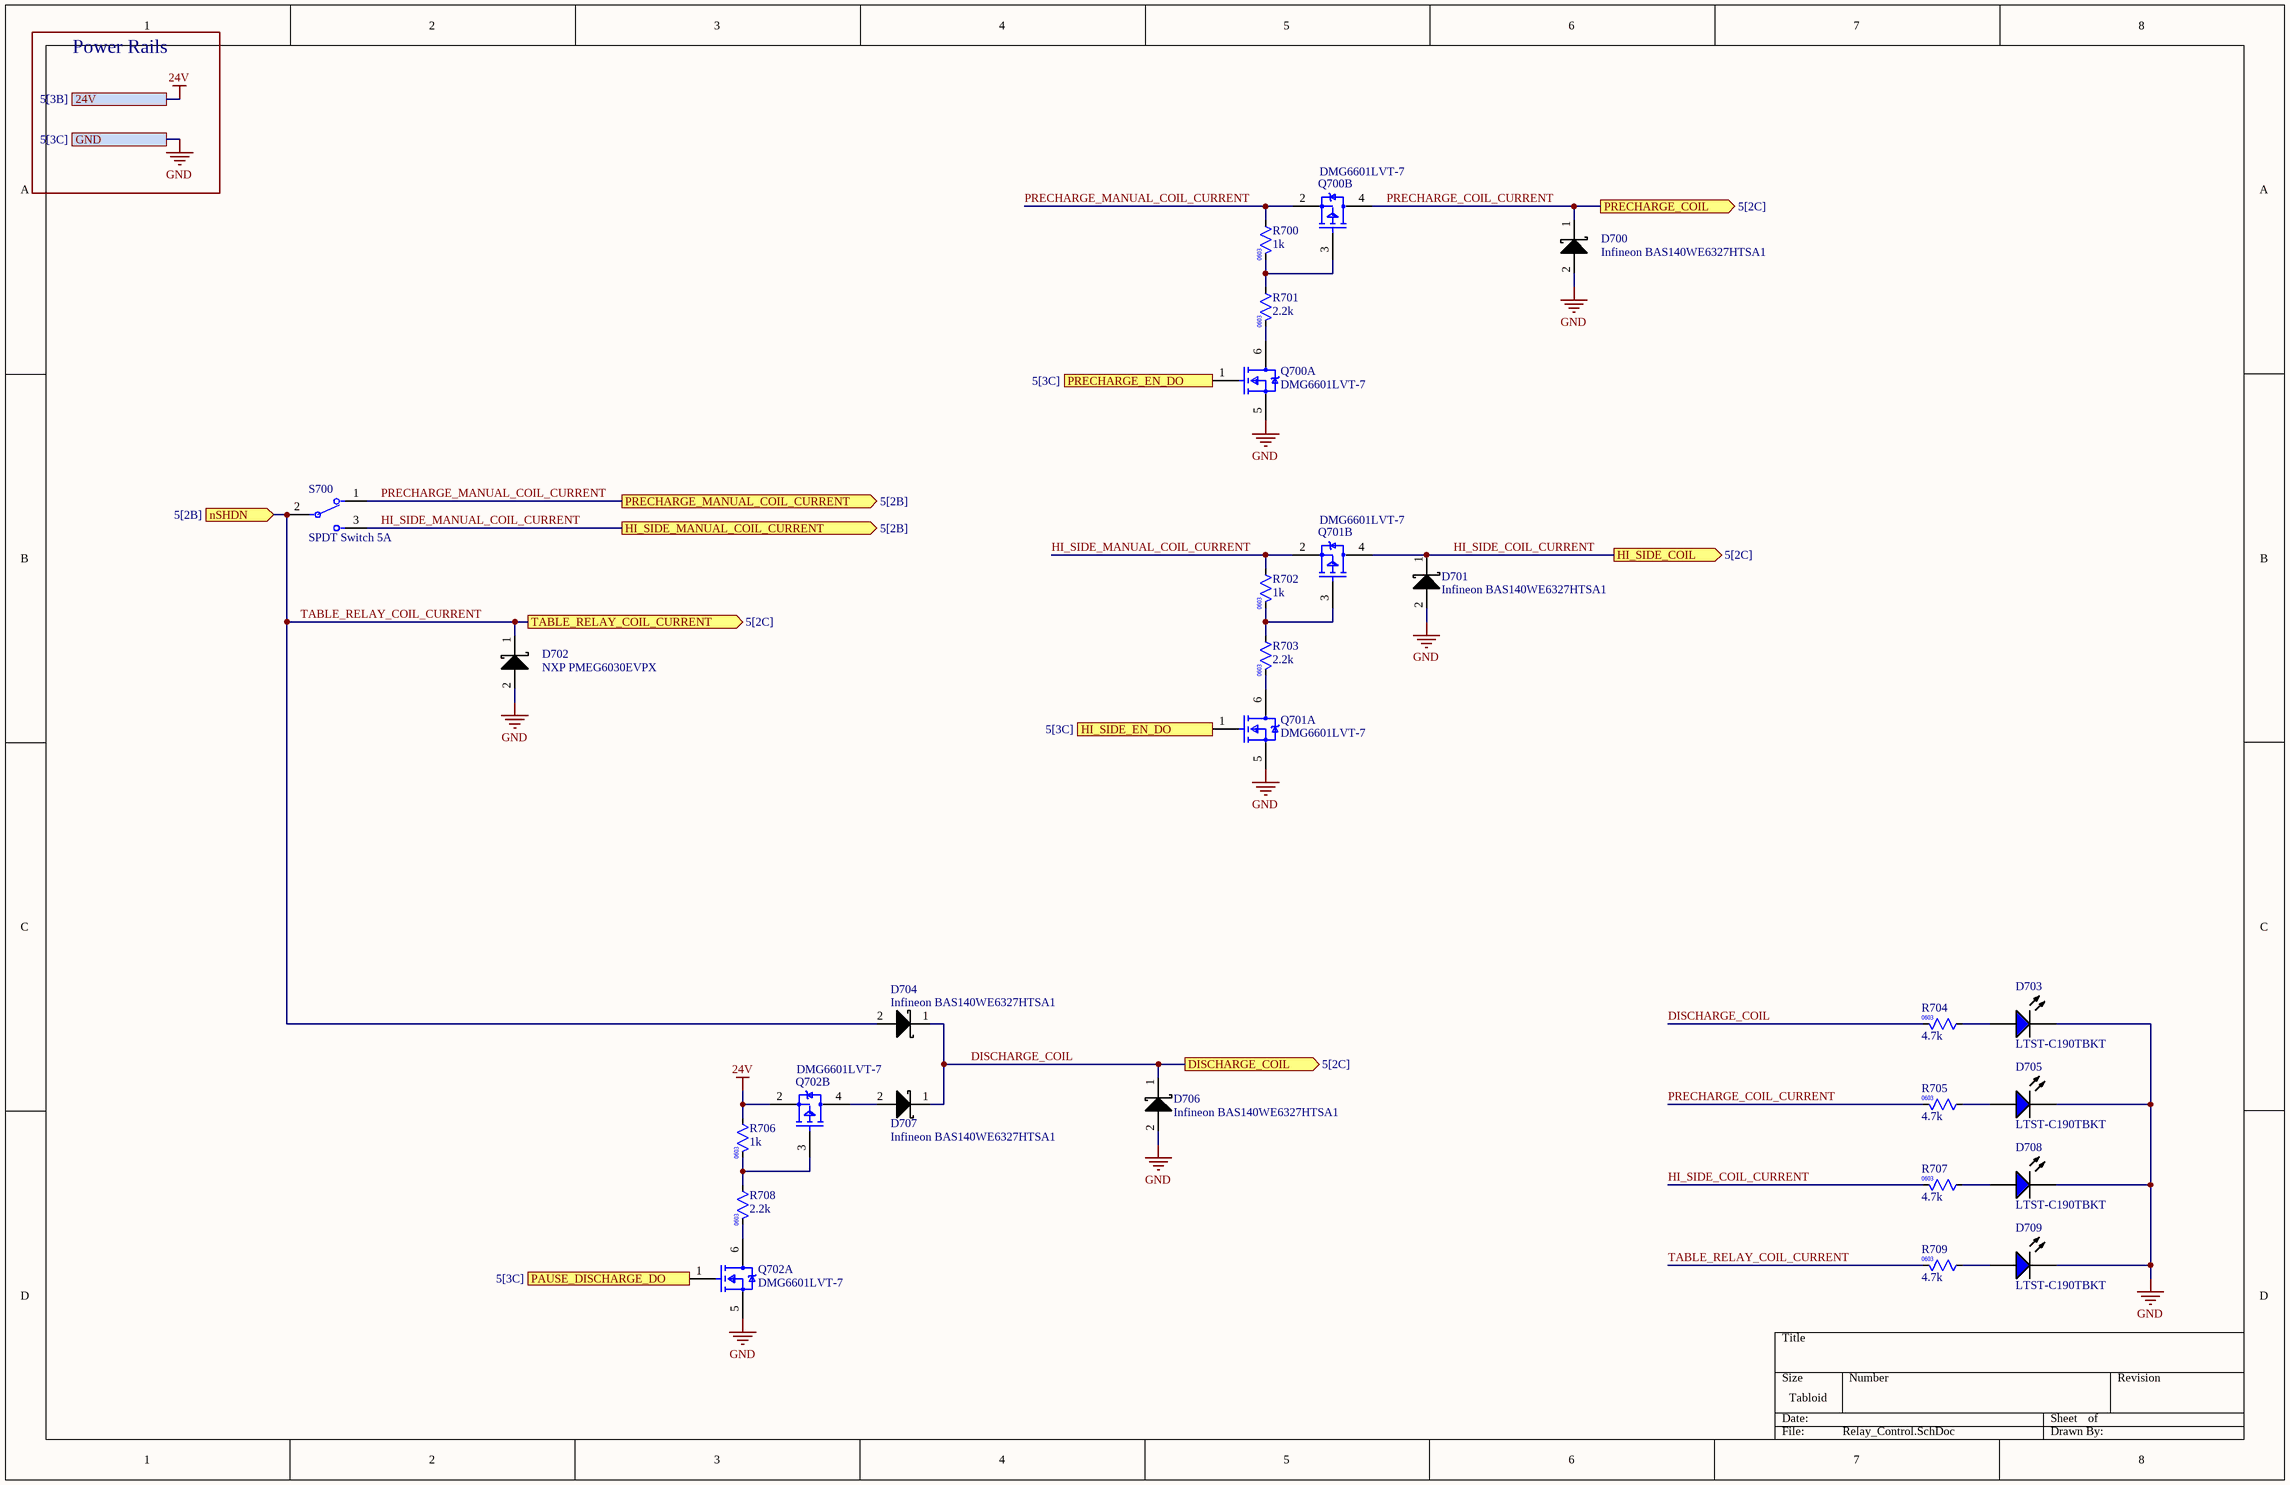
[diagram p5: Relay_Control.SchDoc]

### Parts
D700  Infineon BAS140WE6327HTSA1  [INFINEON BAS140W SERIES]
D701  Infineon BAS140WE6327HTSA1  [INFINEON BAS140W SERIES]
D702  NXP PMEG6030EVPX  [NXP PMEG6030EVPX]
D703  LTST-C190TBKT  [LTST-C190TBKT-2_V]
D704  Infineon BAS140WE6327HTSA1  [INFINEON BAS140W SERIES]
D705  LTST-C190TBKT  [LTST-C190TBKT-2_V]
D706  Infineon BAS140WE6327HTSA1  [INFINEON BAS140W SERIES]
D707  Infineon BAS140WE6327HTSA1  [INFINEON BAS140W SERIES]
D708  LTST-C190TBKT  [LTST-C190TBKT-2_V]
D709  LTST-C190TBKT  [LTST-C190TBKT-2_V]
Q700  DMG6601LVT-7  [FP-TSOT26-IPC_A]  (parts A,B of 2)
Q701  DMG6601LVT-7  [FP-TSOT26-IPC_A]  (parts A,B of 2)
Q702  DMG6601LVT-7  [FP-TSOT26-IPC_A]  (parts A,B of 2)
R700  value 1k  [0603 Resistor Footprint]  (hidden comment: 0603 1k 1% 0.33W)
R701  value 2.2k  [0603 Resistor Footprint]  (hidden comment: 0603 2k2 1% 0.25W)
R702  value 1k  [0603 Resistor Footprint]  (hidden comment: 0603 1k 1% 0.33W)
R703  value 2.2k  [0603 Resistor Footprint]  (hidden comment: 0603 2k2 1% 0.25W)
R704  value 4.7k  [0603 Resistor Footprint]  (hidden comment: 0603 4k7 1% 0.33W)
R705  value 4.7k  [0603 Resistor Footprint]  (hidden comment: 0603 4k7 1% 0.33W)
R706  value 1k  [0603 Resistor Footprint]  (hidden comment: 0603 1k 1% 0.33W)
R707  value 4.7k  [0603 Resistor Footprint]  (hidden comment: 0603 4k7 1% 0.33W)
R708  value 2.2k  [0603 Resistor Footprint]  (hidden comment: 0603 2k2 1% 0.25W)
R709  value 4.7k  [0603 Resistor Footprint]  (hidden comment: 0603 4k7 1% 0.33W)
S700  SPDT Switch 5A  [SPDT 5A]

### Ports
24V (see 5[3B]), DISCHARGE_COIL (out, see 5[2C]), GND (see 5[3C]), HI_SIDE_COIL (out, see 5[2C]), HI_SIDE_EN_DO (in, see 5[3C]), HI_SIDE_MANUAL_COIL_CURRENT (out, see 5[2B]), nSHDN (in, see 5[2B]), PAUSE_DISCHARGE_DO (in, see 5[3C]), PRECHARGE_COIL (out, see 5[2C]), PRECHARGE_EN_DO (in, see 5[3C]), PRECHARGE_MANUAL_COIL_CURRENT (out, see 5[2B]), TABLE_RELAY_COIL_CURRENT (out, see 5[2C])

### Nets
24V: Q702.2(S2) R706.1 ; port 24V
GND: D700.2 D701.2 D702.2 D703.2(K) D705.2(K) D706.2 D708.2(K) D709.2(K) Q700.5(S1) Q701.5(S1) Q702.5(S1) ; port GND
DISCHARGE_COIL: D704.1 D706.1 D707.1 R704.2 ; port DISCHARGE_COIL
HI_SIDE_COIL_CURRENT: D701.1 Q701.4(D2) R707.2 ; port HI_SIDE_COIL
HI_SIDE_MANUAL_COIL_CURRENT: Q701.2(S2) R702.1 S700.3 ; port HI_SIDE_MANUAL_COIL_CURRENT
PRECHARGE_COIL_CURRENT: D700.1 Q700.4(D2) R705.2 ; port PRECHARGE_COIL
PRECHARGE_MANUAL_COIL_CURRENT: Q700.2(S2) R700.1 S700.1 ; port PRECHARGE_MANUAL_COIL_CURRENT
TABLE_RELAY_COIL_CURRENT: D702.1 D704.2 R709.2 S700.2 ; port nSHDN, port TABLE_RELAY_COIL_CURRENT  [project net nSHDN]
NetD703_1: D703.1(A) R704.1
NetD705_1: D705.1(A) R705.1
NetD707_2: D707.2 Q702.4(D2)
NetD708_1: D708.1(A) R707.1
NetD709_1: D709.1(A) R709.1
NetQ700_1: Q700.1(G1) ; port PRECHARGE_EN_DO
NetQ700_3: Q700.3(G2) R700.2 R701.1
NetQ700_6: Q700.6(D1) R701.2
NetQ701_1: Q701.1(G1) ; port HI_SIDE_EN_DO
NetQ701_3: Q701.3(G2) R702.2 R703.1
NetQ701_6: Q701.6(D1) R703.2
NetQ702_1: Q702.1(G1) ; port PAUSE_DISCHARGE_DO
NetQ702_3: Q702.3(G2) R706.2 R708.1
NetQ702_6: Q702.6(D1) R708.2

### Notes on the sheet
- Power Rails
- (in symbol CMP-009-00190-8) 0603

### Library data of the parts
D700 D701 D704 D706 D707 = CMP-024-000030-1: DIODE SCHOTTKY 40V 120MA SOD323; Supplier Part Number 1: BAS140WE6327HTSA1CT-ND; Source: UBC Formula Electric.SchLib; Supplier 1: Digi-Key; Design Item ID: Infineon BAS140WE6327HTSA1
D702 = CMP-011-0009-1: Diode Schottky 60V 3A Surface Mount SOD-128/CFP5; Source: Quad_Inverter.SchLib; Design Item ID: NXP PMEG6030EVPX; Component Type: Standard; Pins: 2
D703 D705 D708 D709 = CMP-007-00026-2: LED Uni-Color Blue, 76 mW, 20 mA, -20 to 80 degC, 2-Pin SMD, RoHS, Tape and Reel; Manufacturer: Lite-On; Viewing Angle: 130degrees; Luminous Intensity: 28mcd; Forward Voltage: 2.8V; Forward Current: 20mA; Lens Style: Diffused; Nominal Vf: 3.3V; Colour: Blue; Packaging: TapeandReel; Datasheet Version: Rev. K, 08/2011; Min Operating Temperature: -20°C; Package Quantity: 3000; Mounting Technology: SM; RoHS Compliant: True; Max Operating Temperature: 80°C; Package Description: 2-Pin Surface Mount Device, Body 1.6 x 0.8 mm; Pins: 2; Illumination Colour: Blue; Manufacturer URL: http://www.us.liteon.com/; Case/Package: 0603; Package Reference: C190TBKT-2; Datasheet URL: http://optoelectronics.liteon.com/upload/download/DS-22-99-0224/S_110_LTST-C190TBKT(0630).pdf
Q700-Q702 = CMP-013-00034-1: Small Signal Field-Effect Transistor, 3.8A I(D), 30V, 2-Element, N-Channel and P-Channel, Silicon, Metal-oxide Semiconductor FET; RoHS Compliant: Yes; Pins: 6
R700 R702 R706 = CMP-009-00184-7: as R203 on sheet Power_Architecture; Max Operating Temperature: 155°C; RoHS Compliant: Yes; Pins: 2; Case/Package: 0603; Tolerance: 1%; Mounting Technology: Surface Mount; Min Operating Temperature: -55°C; Digikey Part Number: 541-1.00KSCT-ND
R701 R703 R708 = CMP-009-00190-8: as R204 on sheet Power_Architecture; Digikey Part Number: 541-10449-1-ND
R704 R705 R707 R709 = CMP-009-00182-7: as R200 on sheet Power_Architecture; Tolerance: 1%; Case/Package: 0603; Pins: 2; RoHS Compliant: Yes; Min Operating Temperature: -55°C; Mounting Technology: Surface Mount; Digikey Part Number: 541-4.70KSCT-ND; Max Operating Temperature: 155°C

## Sheet Monitoring.SchDoc
size Letter; SheetNumber: 9; SheetTotal: 13
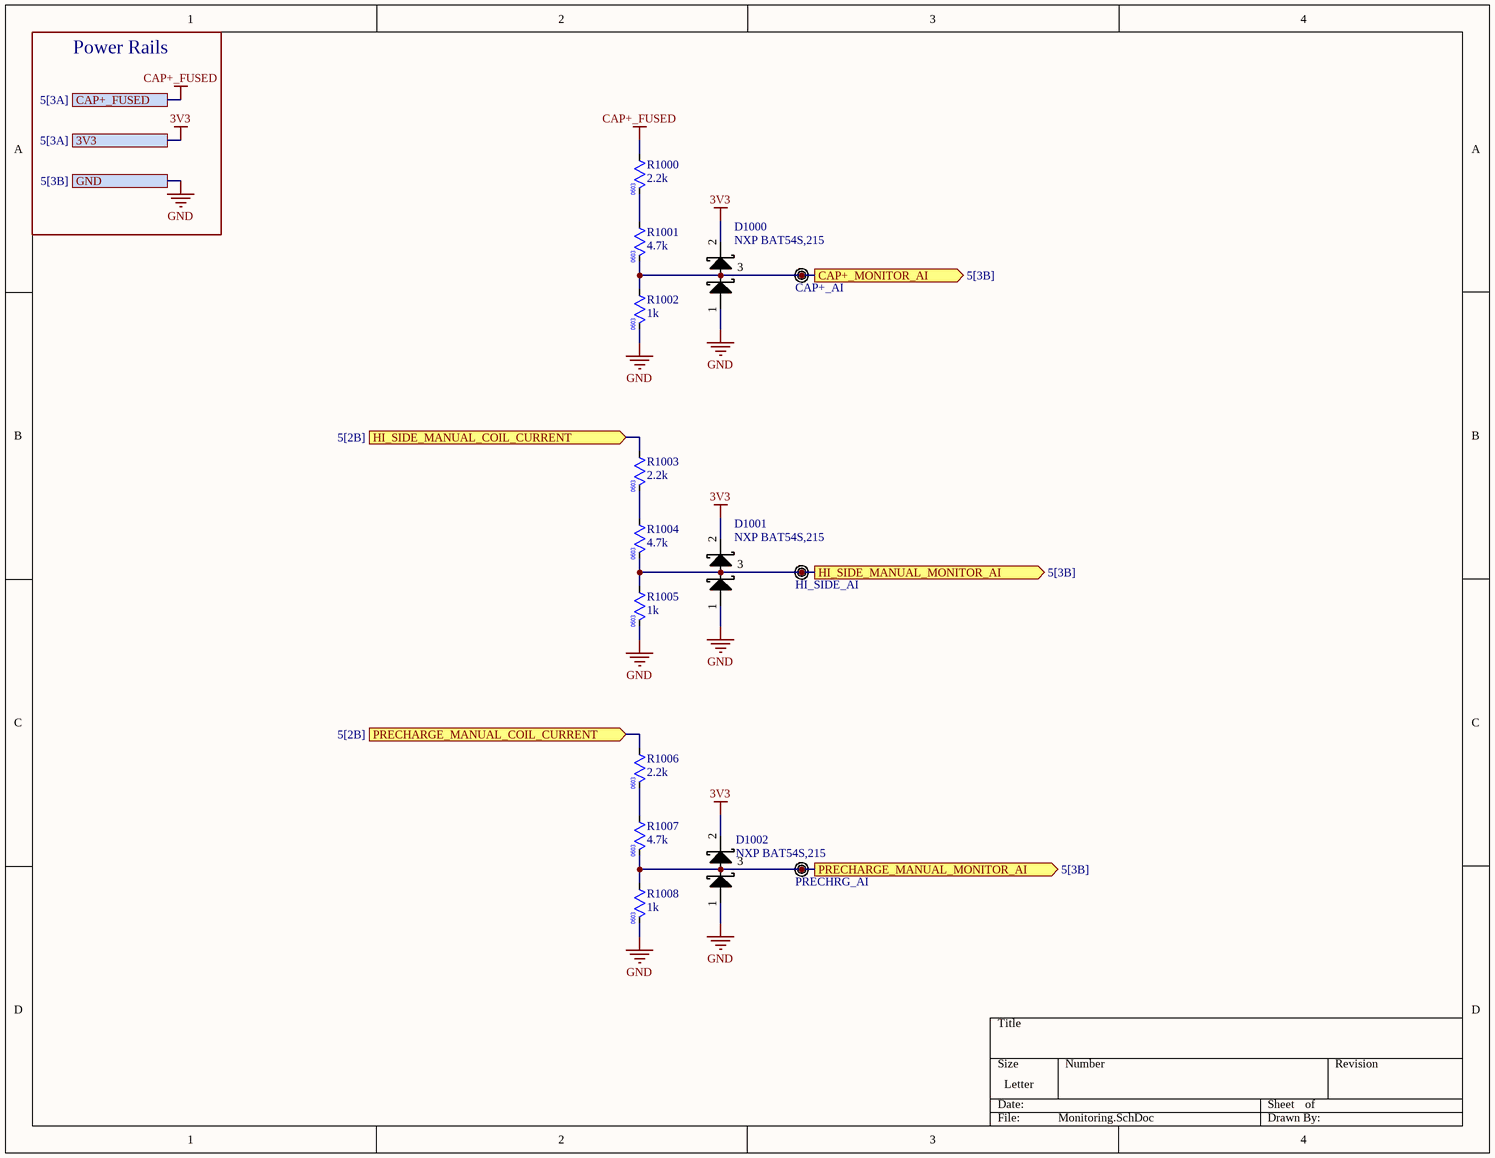
[diagram p6: Monitoring.SchDoc]

### Parts
D1000  NXP BAT54S,215  [NXP BAT54S,215]
D1001  NXP BAT54S,215  [NXP BAT54S,215]
D1002  NXP BAT54S,215  [NXP BAT54S,215]
R1000  value 2.2k  [0603 Resistor Footprint]  (hidden comment: 0603 2k2 1% 0.25W)
R1001  value 4.7k  [0603 Resistor Footprint]  (hidden comment: 0603 4k7 1% 0.33W)
R1002  value 1k  [0603 Resistor Footprint]  (hidden comment: 0603 1k 1% 0.33W)
R1003  value 2.2k  [0603 Resistor Footprint]  (hidden comment: 0603 2k2 1% 0.25W)
R1004  value 4.7k  [0603 Resistor Footprint]  (hidden comment: 0603 4k7 1% 0.33W)
R1005  value 1k  [0603 Resistor Footprint]  (hidden comment: 0603 1k 1% 0.33W)
R1006  value 2.2k  [0603 Resistor Footprint]  (hidden comment: 0603 2k2 1% 0.25W)
R1007  value 4.7k  [0603 Resistor Footprint]  (hidden comment: 0603 4k7 1% 0.33W)
R1008  value 1k  [0603 Resistor Footprint]  (hidden comment: 0603 1k 1% 0.33W)
TP1000  CAP+_AI  [TESTPOINT]  (no BOM)
TP1001  HI_SIDE_AI  [TESTPOINT]  (no BOM)
TP1002  PRECHRG_AI  [TESTPOINT]  (no BOM)

### Ports
3V3 (see 5[3A]), CAP+_FUSED (see 5[3A]), CAP+_MONITOR_AI (out, see 5[3B]), GND (see 5[3B]), HI_SIDE_MANUAL_COIL_CURRENT (in, see 5[2B]), HI_SIDE_MANUAL_MONITOR_AI (out, see 5[3B]), PRECHARGE_MANUAL_COIL_CURRENT (in, see 5[2B]), PRECHARGE_MANUAL_MONITOR_AI (out, see 5[3B])

### Nets
3V3: D1000.2 D1001.2 D1002.2 ; port 3V3
CAP+_FUSED: R1000.1 ; port CAP+_FUSED
GND: D1000.1 D1001.1 D1002.1 R1002.2 R1005.2 R1008.2 ; port GND
HI_SIDE_MANUAL_COIL_CURRENT: R1003.1 ; port HI_SIDE_MANUAL_COIL_CURRENT
PRECHARGE_MANUAL_COIL_CURRENT: R1006.1 ; port PRECHARGE_MANUAL_COIL_CURRENT
NetD1000_3: D1000.3 R1001.2 R1002.1 TP1000.1(TP) ; port CAP+_MONITOR_AI
NetD1001_3: D1001.3 R1004.2 R1005.1 TP1001.1(TP) ; port HI_SIDE_MANUAL_MONITOR_AI
NetD1002_3: D1002.3 R1007.2 R1008.1 TP1002.1(TP) ; port PRECHARGE_MANUAL_MONITOR_AI
NetR1000_2: R1000.2 R1001.1
NetR1003_2: R1003.2 R1004.1
NetR1006_2: R1006.2 R1007.1

### Notes on the sheet
- Power Rails
- (in symbol CMP-009-00190-8) 0603

### Library data of the parts
D1000-D1002 = CMP-011-0005-2: DIODE ARRAY SCHOTTKY 30V SOT23 / Diode Schottky 0.2A Automotive 3-Pin TO-236AB T/R; Forward Voltage: 800mV; Forward Current: 100mA; Case/Package: SOT-23; Mounting Technology: Surface Mount; Max Operating Temperature: 150°C; Min Operating Temperature: -55°C; Pins: 3; RoHS Compliant: Yes; Component Type: Standard; Design Item ID: NXP BAT54S,215
R1000 R1003 R1006 = CMP-009-00190-8: as R204 on sheet Power_Architecture; Digikey Part Number: 541-10449-1-ND
R1001 R1004 R1007 = CMP-009-00182-7: as R200 on sheet Power_Architecture; Min Operating Temperature: -55°C; Pins: 2; Case/Package: 0603; Tolerance: 1%; Max Operating Temperature: 155°C; RoHS Compliant: Yes; Mounting Technology: Surface Mount; Digikey Part Number: 541-4.70KSCT-ND
R1002 R1005 R1008 = CMP-009-00184-7: as R203 on sheet Power_Architecture; Max Operating Temperature: 155°C; RoHS Compliant: Yes; Pins: 2; Case/Package: 0603; Tolerance: 1%; Mounting Technology: Surface Mount; Min Operating Temperature: -55°C; Digikey Part Number: 541-1.00KSCT-ND
TP1000-TP1002 = CMP-020-0000-4: Source: UBC Formula Electric.SchLib; Design Item ID: Thru-Hole Test Point

## Sheet Shutdown_Nodes.SchDoc
size Tabloid; SheetNumber: 8; SheetTotal: 13
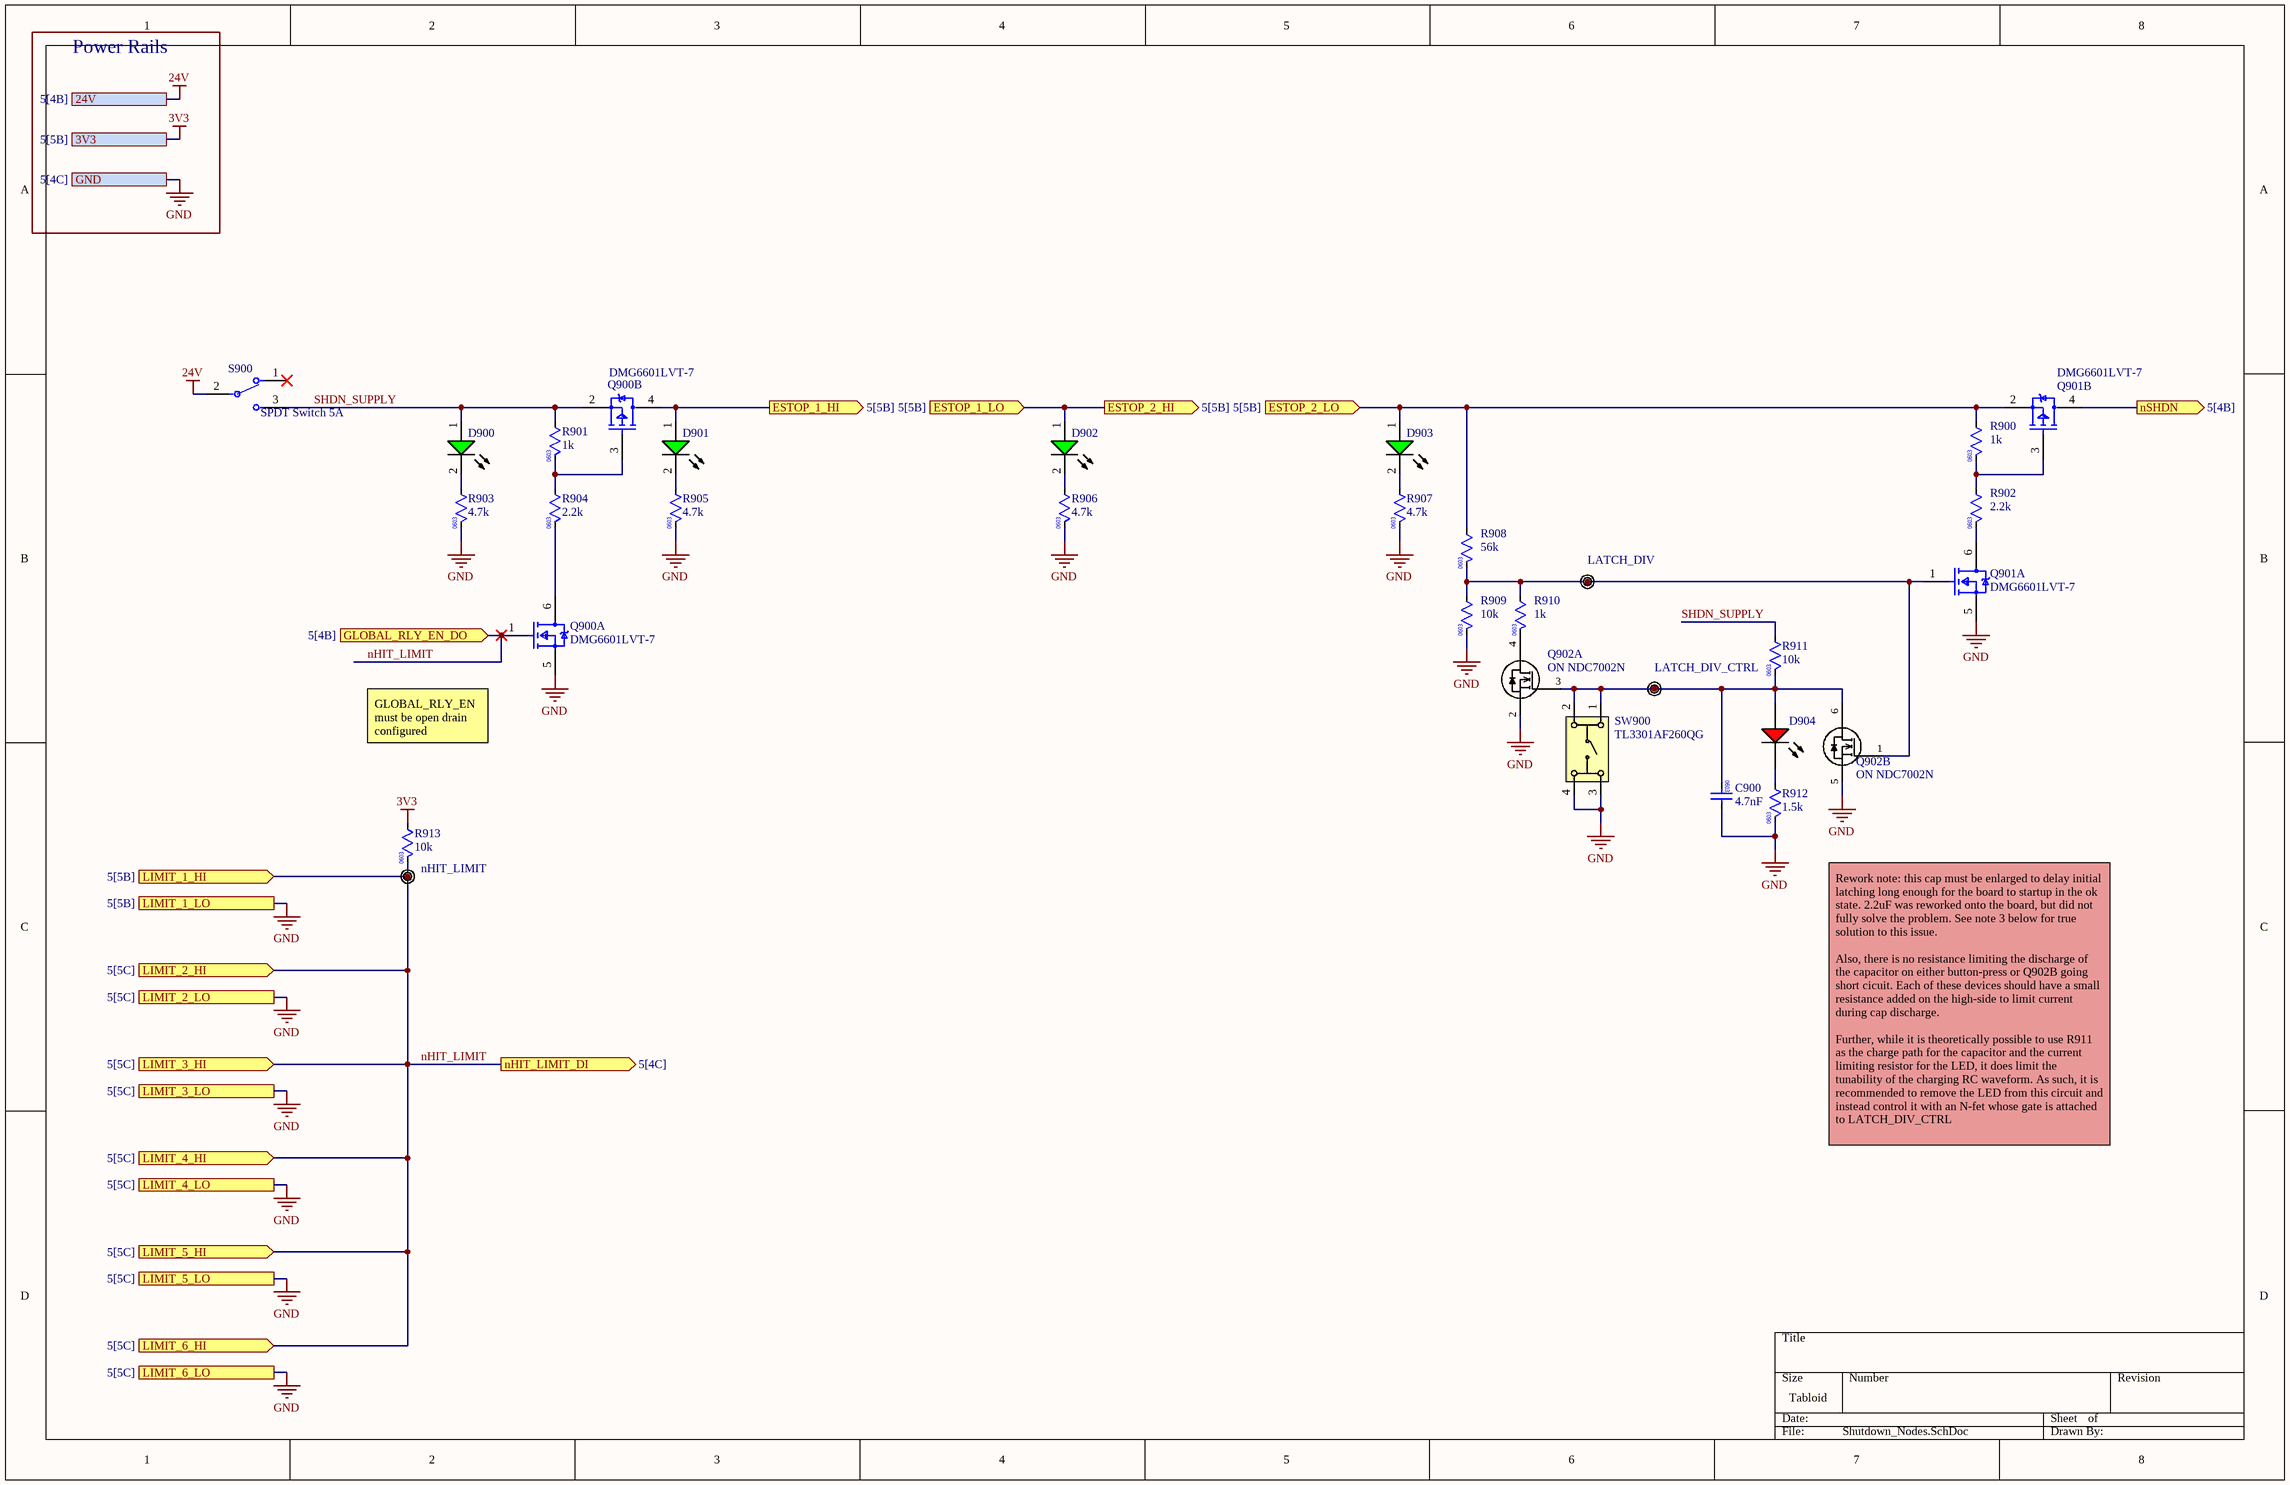
[diagram p7: Shutdown_Nodes.SchDoc]

### Parts
C900  value 4.7nF  [0603 Capacitor Footprint]  (hidden comment: 0603 4.7nF 10% 50V)
D900  Lite-On LTST-C193KGKT-5A  [Lite-On LTST-C193KGKT-5A GREEN (1608)]  (value not drawn)
D901  Lite-On LTST-C193KGKT-5A  [Lite-On LTST-C193KGKT-5A GREEN (1608)]  (value not drawn)
D902  Lite-On LTST-C193KGKT-5A  [Lite-On LTST-C193KGKT-5A GREEN (1608)]  (value not drawn)
D903  Lite-On LTST-C193KGKT-5A  [Lite-On LTST-C193KGKT-5A GREEN (1608)]  (value not drawn)
D904  LTST-C190KRKT  [LTST-C191KRKT_V]  (value not drawn)
Q900  DMG6601LVT-7  [FP-TSOT26-IPC_A]  (parts A,B of 2)
Q901  DMG6601LVT-7  [FP-TSOT26-IPC_A]  (parts A,B of 2)
Q902  ON NDC7002N  [SOT-6]  (parts A,B of 2)
R900  value 1k  [0603 Resistor Footprint]  (hidden comment: 0603 1k 1% 0.33W)
R901  value 1k  [0603 Resistor Footprint]  (hidden comment: 0603 1k 1% 0.33W)
R902  value 2.2k  [0603 Resistor Footprint]  (hidden comment: 0603 2k2 1% 0.25W)
R903  value 4.7k  [0603 Resistor Footprint]  (hidden comment: 0603 4k7 1% 0.33W)
R904  value 2.2k  [0603 Resistor Footprint]  (hidden comment: 0603 2k2 1% 0.25W)
R905  value 4.7k  [0603 Resistor Footprint]  (hidden comment: 0603 4k7 1% 0.33W)
R906  value 4.7k  [0603 Resistor Footprint]  (hidden comment: 0603 4k7 1% 0.33W)
R907  value 4.7k  [0603 Resistor Footprint]  (hidden comment: 0603 4k7 1% 0.33W)
R908  value 56k  [0603 Resistor Footprint]  (hidden comment: 0603 56k 1% 0.33W)
R909  value 10k  [0603 Resistor Footprint]  (hidden comment: 0603 10k 1% 0.3W)
R910  value 1k  [0603 Resistor Footprint]  (hidden comment: 0603 1k 1% 0.33W)
R911  value 10k  [0603 Resistor Footprint]  (hidden comment: 0603 10k 1% 0.3W)
R912  value 1.5k  [0603 Resistor Footprint]  (hidden comment: 0603 1k5 5% 0.25W)
R913  value 10k  [0603 Resistor Footprint]  (hidden comment: 0603 10k 1% 0.3W)
S900  SPDT Switch 5A  [SPDT 5A]
SW900  TL3301AF260QG  [MCU Reset Switch]
TP900  LATCH_DIV  [TESTPOINT]  (no BOM)
TP901  LATCH_DIV_CTRL  [TESTPOINT]  (no BOM)
TP902  nHIT_LIMIT  [TESTPOINT]  (no BOM)

### Ports
3V3 (see 5[5B]), 24V (see 5[4B]), ESTOP_1_HI (out, see 5[5B]), ESTOP_1_LO (in, see 5[5B]), ESTOP_2_HI (out, see 5[5B]), ESTOP_2_LO (in, see 5[5B]), GLOBAL_RLY_EN_DO (in, see 5[4B]), GND (see 5[4C]), LIMIT_1_HI (in, see 5[5B]), LIMIT_1_LO (see 5[5B]), LIMIT_2_HI (in, see 5[5C]), LIMIT_2_LO (see 5[5C]), LIMIT_3_HI (in, see 5[5C]), LIMIT_3_LO (see 5[5C]), LIMIT_4_HI (in, see 5[5C]), LIMIT_4_LO (see 5[5C]), LIMIT_5_HI (in, see 5[5C]), LIMIT_5_LO (see 5[5C]), LIMIT_6_HI (in, see 5[5C]), LIMIT_6_LO (see 5[5C]), nHIT_LIMIT_DI (out, see 5[4C]), nSHDN (out, see 5[4B])

### Nets
3V3: R913.1 ; port 3V3
24V: S900.2 ; port 24V
GND: C900.1 Q900.5(S1) Q901.5(S1) Q902.2(SOURCE1) Q902.5(SOURCE2) R903.2 R905.2 R906.2 R907.2 R909.2 R912.2 SW900.3 SW900.4 ; port LIMIT_1_LO, port LIMIT_2_LO, port LIMIT_3_LO, port LIMIT_4_LO, port LIMIT_5_LO, port LIMIT_6_LO, port GND
nHIT_LIMIT: Q900.1(G1) R913.2 TP902.1(TP) ; port GLOBAL_RLY_EN_DO, port LIMIT_1_HI, port LIMIT_2_HI, port LIMIT_3_HI, port LIMIT_4_HI, port LIMIT_5_HI, port LIMIT_6_HI, port nHIT_LIMIT_DI
nSHDN: Q901.4(D2) ; port nSHDN
SHDN_SUPPLY: D900.1(A) Q900.2(S2) R901.1 R911.1 S900.3
NetC900_2: C900.2 D904.1(A) Q902.3(GATE1) Q902.6(DRAIN2) R911.2 SW900.1 SW900.2 TP901.1(TP)
NetD900_2: D900.2(K) R903.1
NetD901_1: D901.1(A) Q900.4(D2) ; port ESTOP_1_HI
NetD901_2: D901.2(K) R905.1
NetD902_1: D902.1(A) ; port ESTOP_1_LO, port ESTOP_2_HI
NetD902_2: D902.2(K) R906.1
NetD903_1: D903.1(A) Q901.2(S2) R900.1 R908.1 ; port ESTOP_2_LO
NetD903_2: D903.2(K) R907.1
NetD904_2: D904.2(K) R912.1
NetQ900_3: Q900.3(G2) R901.2 R904.1
NetQ900_6: Q900.6(D1) R904.2
NetQ901_1: Q901.1(G1) Q902.1(GATE2) R908.2 R909.1 R910.1 TP900.1(TP)
NetQ901_3: Q901.3(G2) R900.2 R902.1
NetQ901_6: Q901.6(D1) R902.2
NetQ902_4: Q902.4(DRAIN1) R910.2

Not connected (* = marked no-connect by the designer): S900 1*

### Notes on the sheet
- Power Rails
- GLOBAL_RLY_EN must be open drain configured
- Rework note: this cap must be enlarged to delay initial latching long enough for the board to startup in the ok state. 2.2uF was reworked onto the board, but did not fully solve the problem. See note 3 below for true solution to this issue.
  Also, there is no resistance limiting the discharge of the capacitor on either button-press or Q902B going short cicuit. Each of these devices should have a small resistance added on the high-side to limit current during cap discharge.
  Further, while it is theoretically possible to use R911 as the charge path for the capacitor and the current limiting resistor for the LED, it does limit the tunability of the charging RC waveform. As such, it is recommended to remove the LED from this circuit and instead control it with an N-fet whose gate is attached to LATCH_DIV_CTRL
- (in symbol CMP-009-00190-8) 0603

### Library data of the parts
C900 = CMP-001-00087-1: as C200 on sheet Power_Architecture; Max Operating Temperature: 125°C; Case/Package: 0603; Capacitor Type: Ceramic; Min Operating Temperature: -55°C; Tolerance: 10%; Supplier Part Number 1: 13-CC0603KPX7R9BB101CT-ND; RoHS Compliant: Yes; Temperature Characteristics Code: X7R; Mounting Technology: Surface Mount; Source: UBC Formula Electric.SchLib; Voltage Rating: 50V; Pins: 2
D900-D903 = CMP-026-000009-1: LED GREEN CLEAR CHIP SMD; Source: UBC Formula Electric.SchLib; Supplier 1: Digi-Key; Supplier Part Number 1: 160-1828-1-ND; Design Item ID: Lite-On LTST-C193KGKT-5A
D904 = CMP-007-00024-1: LED Uni-Color Red, 62.5 mW, 25 mA, -30 to 85 degC, 2-Pin SMD, RoHS, Tape and Reel; Manufacturer: Lite-On; Luminous Intensity: 54mcd; Nominal Vf: 2V; Power: 75mW; Viewing Angle: 130degrees; Lens Style: Diffused; Forward Current: 20mA; Datasheet URL: http://optoelectronics.liteon.com/upload/download/DS-22-99-0151/S_110_LTST-C190KRKT.pdf; Pins: 2; Package Quantity: 3000; RoHS Compliant: True; Packaging: TapeandReel; Package Reference: C191KRKT; Colour: Red; Case/Package: 0603; Package Description: 2-Pin Surface Mount Device, Body 1.6 x 0.8 mm; Min Operating Temperature: -55°C; Forward Voltage: 2V; Illumination Colour: Red; Manufacturer URL: http://www.us.liteon.com/; Mounting Technology: SM; Datasheet Version: Rev. F, 05/2013; Max Operating Temperature: 85°C
Q900 Q901 = CMP-013-00034-1: as Q700 on sheet Relay_Control; RoHS Compliant: Yes; Pins: 6
Q902 = CMP-016-000001-4: MOSFET 2N-CH 50V 0.51A SSOT6; Manufacturer: ON Semiconductor / Fairchild; Rise Time: 6ns; Current Rating: 350mA; On-State Resistance: 2R; Power Dissipation: 960mW; FET Type: 2 N-Channel; Input Capacitance: 20pF; Continuous Drain Current (ID): 510mA; Number of Elements: 2; Element Configuration: Dual; Gate to Source Voltage (Vgs): 20V; Max Power Dissipation: 700mW; Nominal Vgs: 1.9V; Turn-Off Delay Time: 11ns; ComponentLink15Description: https://datasheet.ciiva.com/8114/ndc7002n-8114748.pdf?src-supplier=Avnet; ComponentLink1URL: https://datasheet.ciiva.com/927/ndc7002n-927936.pdf?src-supplier=Digi-Key; ComponentLink9URL: https://datasheet.ciiva.com/17062/ndc7002n-17062122.pdf?src-supplier=Future+Electronics; Category: MOSFETs; ComponentLink5URL: https://datasheet.ciiva.com/26788/ndc7002n-26788993.pdf?src-supplier=IIIC; Contact Plating: Tin,Matte; ComponentLink10URL: https://datasheet.ciiva.com/22681/276179-22681804.pdf?src-supplier=Element14; ComponentLink16Description: https://datasheet.ciiva.com/48701/001264957-da-01-en-mosfet-2n-ch-50v-5-ndc7002n-sot-23-6-fsc-48701131.pdf?src-supplier=Conrad; ComponentLink9Description: https://datasheet.ciiva.com/17062/ndc7002n-17062122.pdf?src-supplier=Future+Electronics; Lead Free: Lead Free; ComponentLink13Description: https://datasheet.ciiva.com/28548/276179-28548207.pdf?src-supplier=Element14; ComponentLink12Description: https://datasheet.ciiva.com/22681/276179-22681805.pdf?src-supplier=Element14; ComponentLink3URL: https://datasheet.ciiva.com/4441/ndc7002n-97690-4441778.pdf?src-supplier=Mouser; Case/Package: SOT-23-6; ComponentLink14URL: https://datasheet.ciiva.com/15137/getdatasheetpartid-81737-15137541.pdf?src-supplier=Verical; Packaging: Tape and Reel; ComponentLink7Description: https://datasheet.ciiva.com/927/ndc7002n-927938.pdf?src-supplier=Digi-Key; Max Operating Temperature: 150°C; Turn-On Delay Time: 6ns; Design Item ID: ON NDC7002N; RoHS Compliant: Yes; Number of Pins: 6; ComponentLink4URL: https://datasheet.ciiva.com/34301/1030156-34301891.pdf?src-supplier=Jameco; ComponentLink14Description: https://datasheet.ciiva.com/15137/getdatasheetpartid-81737-15137541.pdf?src-supplier=Verical; Package Quantity: 1; ComponentLink6Description: https://datasheet.ciiva.com/927/ndc7002n-927937.pdf?src-supplier=Digi-Key; Supplier Part Number 1: NDC7002NCT-ND; RoHS: Yes; Rds On Max: 2R; Fall Time: 6ns; ComponentLink1Description: https://datasheet.ciiva.com/927/ndc7002n-927936.pdf?src-supplier=Digi-Key; ComponentLink13URL: https://datasheet.ciiva.com/28548/276179-28548207.pdf?src-supplier=Element14; Stock 1: 634459; ComponentLink16URL: https://datasheet.ciiva.com/48701/001264957-da-01-en-mosfet-2n-ch-50v-5-ndc7002n-sot-23-6-fsc-48701131.pdf?src-supplier=Conrad; Supplier 1: Digi-Key; ComponentLink8Description: https://datasheet.ciiva.com/26252/ndc7002n-26252213.pdf?src-supplier=Avnet+Europe; Source: UBC Formula Electric.SchLib; Weight: 0.036g; ComponentLink15URL: https://datasheet.ciiva.com/8114/ndc7002n-8114748.pdf?src-supplier=Avnet; ComponentLink11URL: https://datasheet.ciiva.com/46382/276179-46382956.pdf?src-supplier=Element14; Voltage Rating (DC): 50V; Dual Supply Voltage: 50V; Drain to Source Breakdown Voltage: 50V; ComponentLink6URL: https://datasheet.ciiva.com/927/ndc7002n-927937.pdf?src-supplier=Digi-Key; Drain to Source Voltage (Vdss): 50V; ComponentLink8URL: https://datasheet.ciiva.com/26252/ndc7002n-26252213.pdf?src-supplier=Avnet+Europe; Height: 1mm; Min Operating Temperature: -55°C; REACH SVHC: No SVHC; ComponentLink2Description: https://datasheet.ciiva.com/6039/276179-6039921.pdf?src-supplier=Farnell; ComponentLink4Description: https://datasheet.ciiva.com/34301/1030156-34301891.pdf?src-supplier=Jameco; Mount: Surface Mount; Radiation Hardening: No; Length: 3mm; Width: 1.7mm; Drain to Source Resistance: 2R; ComponentLink3Description: https://datasheet.ciiva.com/4441/ndc7002n-97690-4441778.pdf?src-supplier=Mouser; Manufacturer Part Number: NDC7002N; ComponentLink10Description: https://datasheet.ciiva.com/22681/276179-22681804.pdf?src-supplier=Element14; ComponentLink5Description: https://datasheet.ciiva.com/26788/ndc7002n-26788993.pdf?src-supplier=IIIC; ComponentLink2URL: https://datasheet.ciiva.com/6039/276179-6039921.pdf?src-supplier=Farnell; Pricing 1: 1=0.47000, 10=0.36400, 25=0.34800, 100=0.21860, 500=0.20240, 1000=0.13763 (USD); ComponentLink12URL: https://datasheet.ciiva.com/22681/276179-22681805.pdf?src-supplier=Element14; Threshold Voltage: 1.9V; ComponentLink7URL: https://datasheet.ciiva.com/927/ndc7002n-927938.pdf?src-supplier=Digi-Key; ComponentLink11Description: https://datasheet.ciiva.com/46382/276179-46382956.pdf?src-supplier=Element14
R900 R901 R910 = CMP-009-00184-7: as R203 on sheet Power_Architecture; Max Operating Temperature: 155°C; RoHS Compliant: Yes; Pins: 2; Case/Package: 0603; Tolerance: 1%; Mounting Technology: Surface Mount; Min Operating Temperature: -55°C; Digikey Part Number: 541-1.00KSCT-ND
R902 R904 = CMP-009-00190-8: as R204 on sheet Power_Architecture; Digikey Part Number: 541-10449-1-ND
R903 R905-R907 = CMP-009-00182-7: as R200 on sheet Power_Architecture; Tolerance: 1%; Case/Package: 0603; Pins: 2; RoHS Compliant: Yes; Min Operating Temperature: -55°C; Mounting Technology: Surface Mount; Digikey Part Number: 541-4.70KSCT-ND; Max Operating Temperature: 155°C
R908 = CMP-009-00197-3: RES SMD 56K OHM 1% 1/3W 0603; Power: 333mW; Mounting Technology: Surface Mount; Tolerance: 1%; Case/Package: 0603; RoHS Compliant: Yes; Min Operating Temperature: -55°C; Pins: 2; Max Operating Temperature: 155°C
R909 R911 R913 = CMP-009-00181-10: as R201 on sheet Power_Architecture; Case/Package: 0603; Max Operating Temperature: 155°C; Min Operating Temperature: -55°C; Pins: 2; Digikey Part Number: 541-10.0KSCT-ND; RoHS Compliant: Yes; Tolerance: 1%; Mounting Technology: Surface Mount
R912 = CMP-009-00198-1: Res Thick Film 0603 1.5K Ohm 5% 0.25W(1/4W) ±200ppm/C Pad SMD Automotive T/R; Manufacturer Part Number: ERJ-PA3J152V; Power: 250mW; Case/Package: 0603; Min Operating Temperature: -55°C; Pins: 2; Max Operating Temperature: 155°C; Tolerance: 5%; Digikey Part Number: P1.5KBZCT-ND; RoHS Compliant: Yes; Mounting Technology: Surface Mount
SW900 = CMP-027-000004-1: SWITCH TACTILE SPST-NO 0.05A 12V; Design Item ID: E-Switch TL3301AF260QG; Supplier Part Number 1: EG2527CT-ND; Supplier 1: Digi-Key; Source: UBC Formula Electric.SchLib
TP900-TP902 = CMP-020-0000-4: Source: UBC Formula Electric.SchLib; Design Item ID: Thru-Hole Test Point